# EasyEDA Pro project ProPrj_TC264 2025-12.27(1).epro

# Schematic Schematic1
Board Name: Board1; Create Date: 2025-09-16; Page Name: P1; Project Name: TC264; Schematic Name: Schematic1; Update Date: 2025-10-17; Company: 嘉立创EDA; Page Size: A4; Version: V1.0
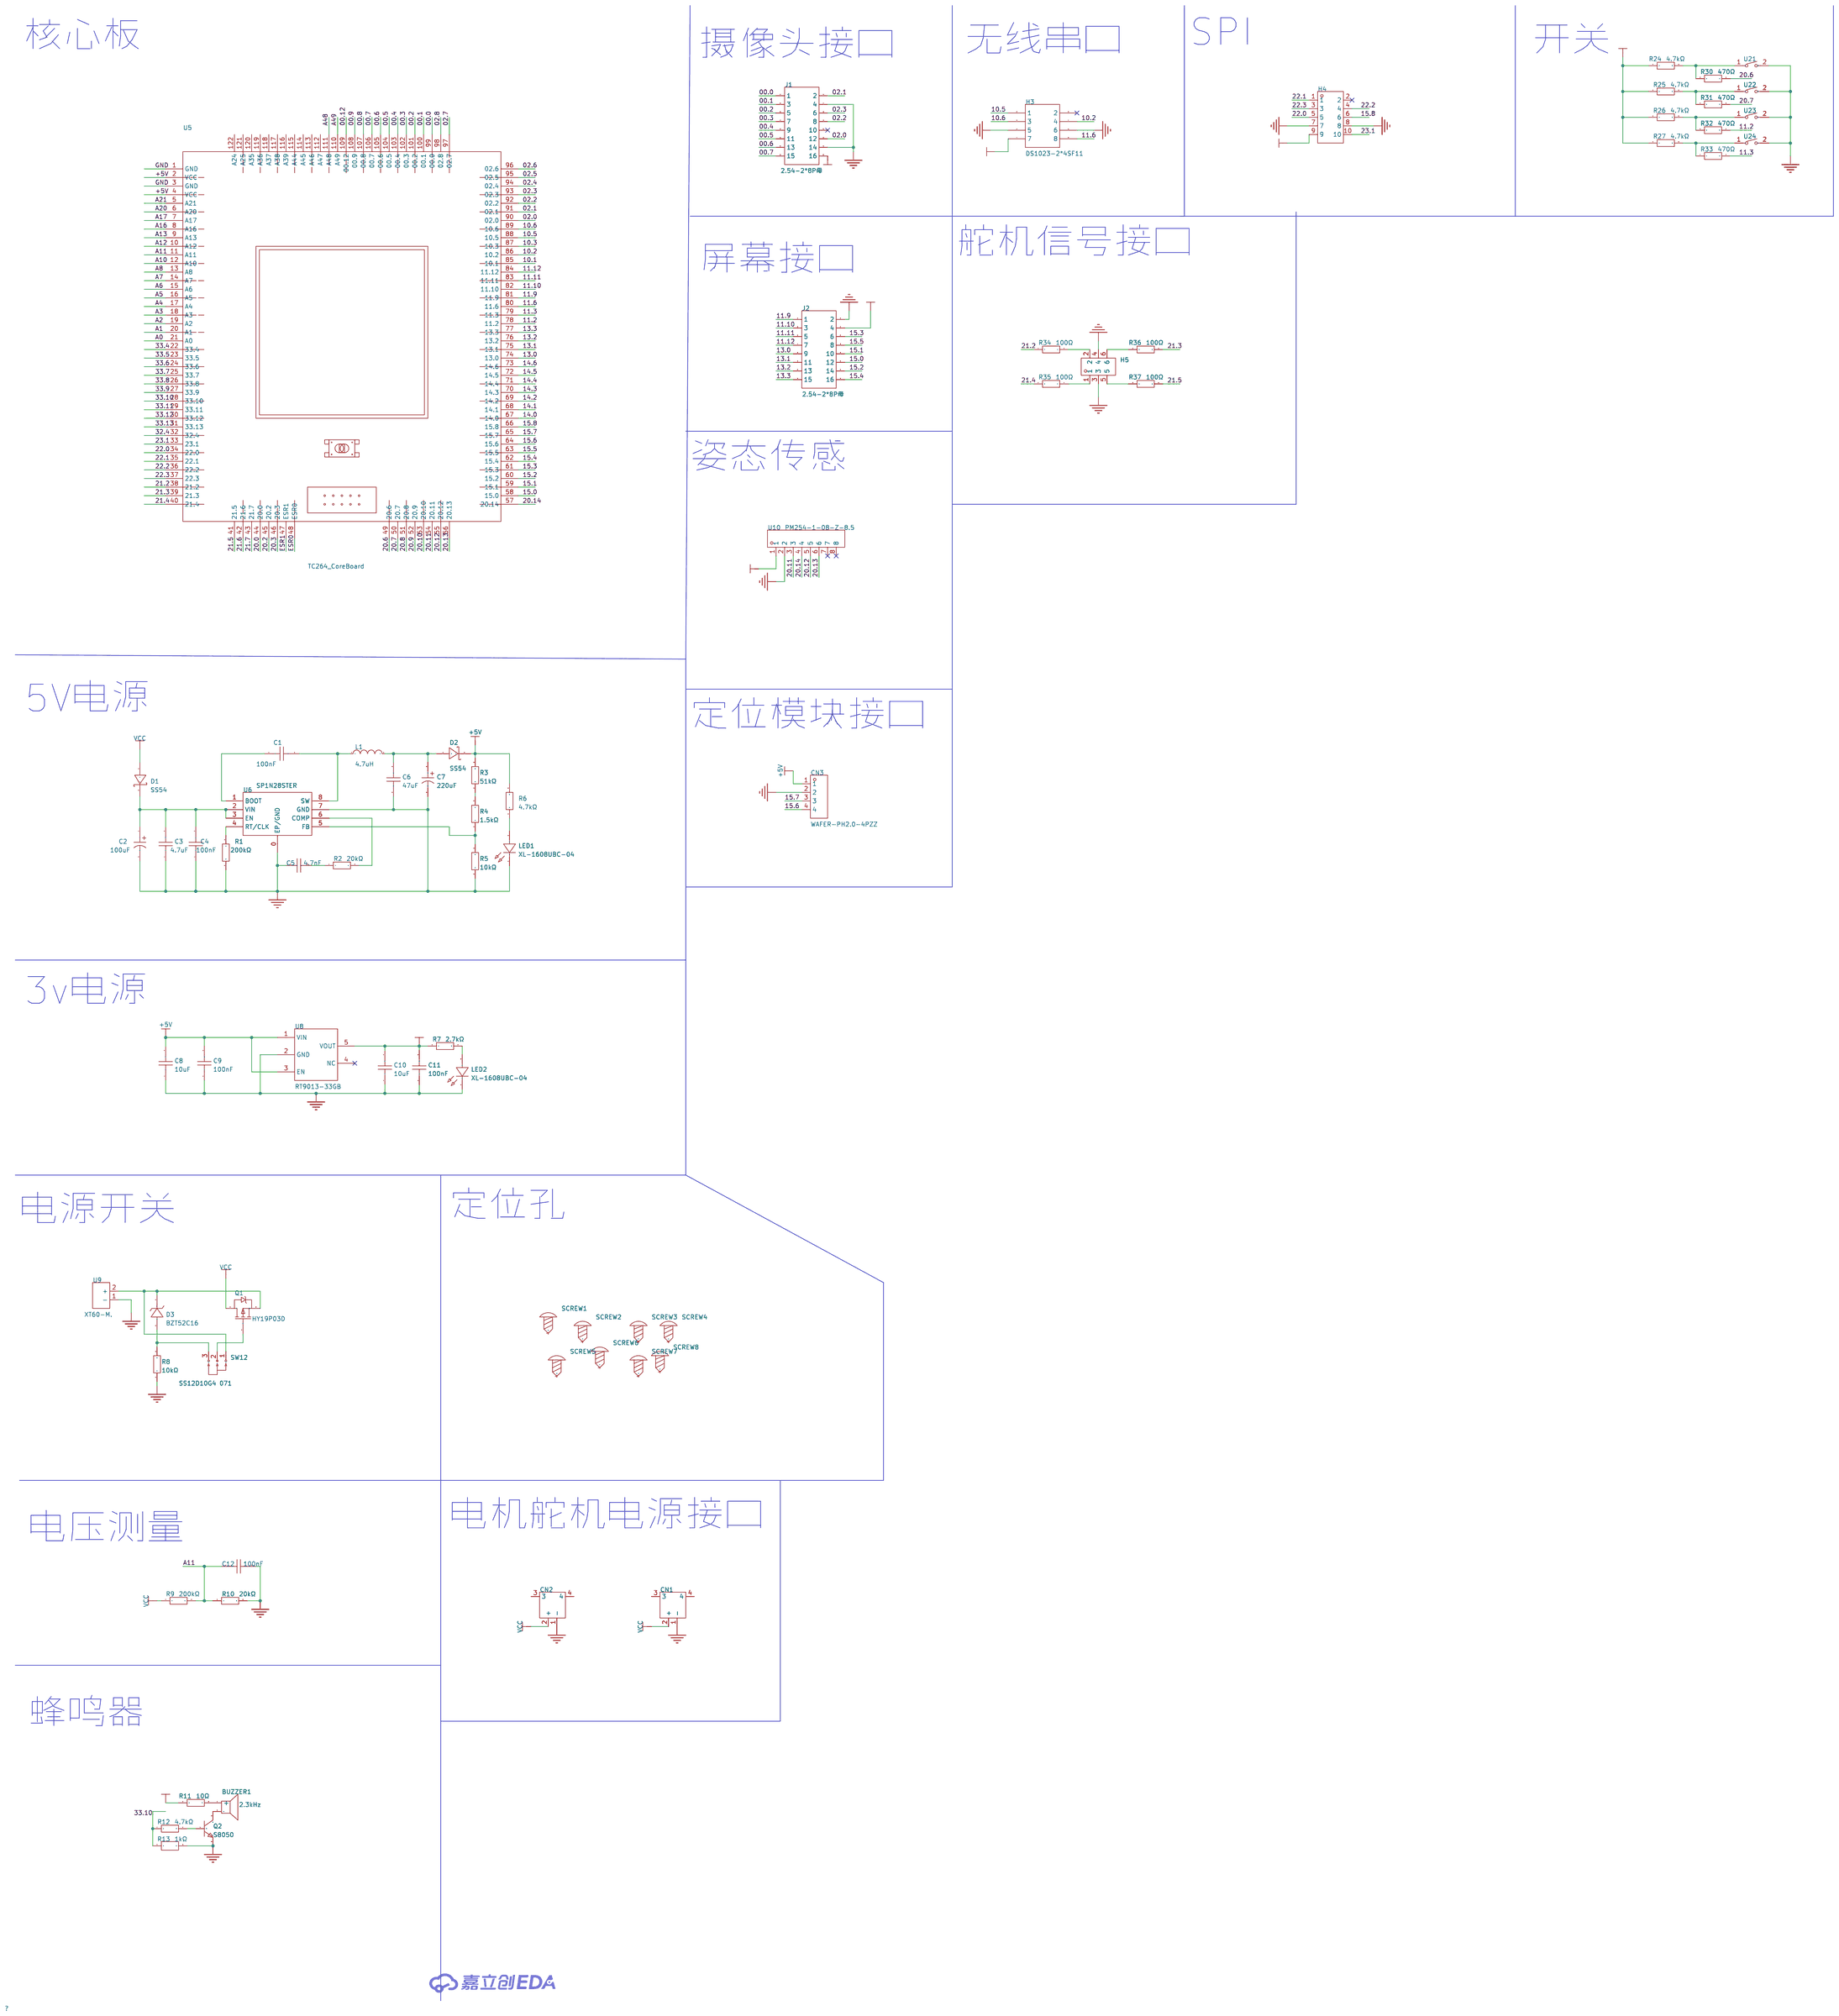
[diagram p0: schematic sheet]

## Parts
BUZZER1  2.3kHz  [BUZ-TH_BD12.0-P7.60-D0.6-FD]
C1  100nF  [C0603]
C2  100uF  [CAP-SMD_BD6.3-L6.6-W6.6-FD-1]
C3  4.7uF  [C1206]
C4  100nF  [C0603]
C5  4.7nF  [C0603]
C6  47uF  [C1206]
C7  220uF  [CAP-SMD_BD6.3-L6.6-W6.6-FD-1]
C8  10uF  [C0603]
C9  100nF  [C0603]
C10  10uF  [C0603]
C11  100nF  [C0603]
C12  100nF  [C0603]
CN1  XT30PW-M30.G.Y  [CONN-TH_XT30PW-M]
CN2  XT30PW-M30.G.Y  [CONN-TH_XT30PW-M]
CN3  WAFER-PH2.0-4PZZ  [CONN-TH_4P-P2.00_FWF20001-S04S22W5B]
D1  SS54  [footprint_93fc]
D2  SS54  [SMA_L4.4-W2.8-LS5.4-R-RD]
D3  BZT52C16  [SOD-123_L2.7-W1.7-LS3.8-RD]
H3  DS1023-2*4SF11  [HDR-TH_8P-P2.54-V-F-R2-C4-S2.54]
H4  PM254V-12-10P-H85  [HDR-TH_10P-P2.54-V-F-R2-C5-S2.54]
H5  PZ254V-12-6P  [HDR-TH_6P-P2.54-V-M-R2-C3-S2.54]
J1  2.54-2*8P母  [HDR-TH_16P-P2.54-V-F-R2-C8-S2.54]
J2  2.54-2*8P母  [HDR-TH_16P-P2.54-V-F-R2-C8-S2.54]
L1  4.7uH  [IND-SMD_L5.4-W5.2_FXL0530]
LED1  XL-1608UBC-04  [LED0603-RD_BLUE]
LED2  XL-1608UBC-04  [LED0603-RD_BLUE]
Q1  HY19P03D  [TO-252-2_L6.6-W6.1-P4.57-LS9.9-TL-CW]
Q2  S8050  [SOT-23-3_L3.0-W1.7-P0.95-LS2.9-BR]
R1  200kΩ  [R0805]
R2  20kΩ  [R0805]
R3  51kΩ  [R0805]
R4  1.5kΩ  [R0805]
R5  10kΩ  [R0805]
R6  4.7kΩ  [R0805]
R7  2.7kΩ  [R0805]
R8  10kΩ  [R0805]
R9  200kΩ  [R0603]
R10  20kΩ  [R0603]
R11  10Ω  [R0603]
R12  4.7kΩ  [R0603]
R13  1kΩ  [R0603]
R24  4.7kΩ  [R0603]
R25  4.7kΩ  [R0603]
R26  4.7kΩ  [R0603]
R27  4.7kΩ  [R0603]
R30  470Ω  [R0603]
R31  470Ω  [R0603]
R32  470Ω  [R0603]
R33  470Ω  [R0603]
R34  100Ω  [R0603]
R35  100Ω  [R0603]
R36  100Ω  [R0603]
R37  100Ω  [R0603]
SCREW1  -  [M3螺丝]
SCREW2  -  [M3螺丝]
SCREW3  -  [M3螺丝]
SCREW4  -  [M3螺丝]
SCREW5  -  [M3螺丝]
SCREW6  -  [M3螺丝]
SCREW7  -  [M3螺丝]
SCREW8  -  [M3螺丝]
SW12  SS12D10G4 071  [SW-TH_SHOU-HAN_SS12D10G4]
U5  TC264_CoreBoard  [TC264_main]
U6  SP1N28STER  [SOP-8E]
U8  RT9013-33GB  [SOT-23-5_L3.0-W1.7-P0.95-LS2.8-BL]
U9  XT60-M.  [CONN-TH_XT60]
U10  PM254-1-08-Z-8.5  [HDR-TH_8P-P2.54-V-F]
U21  GT-TC060A-H025-L1  [SW-SMD_L6.1-W3.5-LS8.0]
U22  GT-TC060A-H025-L1  [SW-SMD_L6.1-W3.5-LS8.0]
U23  GT-TC060A-H025-L1  [SW-SMD_L6.1-W3.5-LS8.0]
U24  GT-TC060A-H025-L1  [SW-SMD_L6.1-W3.5-LS8.0]

## Library data of the parts
BUZZER1 = TMB12A03: 驱动方式:有源(内含驱动线路);构造类型:电磁式;频率:2.3kHz;声压(SPL):85dB;; Supplier Part: C96222; Manufacturer: 华能; Supplier Footprint: 插件,D=12mm; JLCPCB Part Class: 扩展库; Datasheet: https://item.szlcsc.com/datasheet/TMB12A03/97426.html; Supplier: LCSC; Driver Circuitry: 有源(内含驱动线路); Technology: 电磁式; Voltage - Supply: 1.5V~4V; Sound Pressure Level(SPL): 85dB; Diameter(φD): 12mm; Height: 9.8mm
C1 = X-100nF-C0603-TP: 容值:100nF;精度:±10%;额定电压:50V;材质(温度系数):X7R;; Supplier: LCSC; Supplier Part: C14663; Supplier Footprint: 0603; JLCPCB Part Class: Basic Part; LCSC Part Name: 100nF ±10% 50V; Tolerance: ±10%; Datasheet: https://atta.szlcsc.com/upload/public/pdf/source/20170116/1484561234239.pdf; Manufacturer: YAGEO(国巨); Manufacturer Part: CC0603KRX7R9BB104; Temperature Coefficient: X7R; Voltage Rated: 50V
C2 = JVJ25V100M6x5: 容值:100uF;精度:±20%;额定电压:25V;纹波电流:72mA@120Hz;; LCSC Part Name: 100uF ±20% 25V; Supplier Part: C46550402; Manufacturer: JIERR(捷而瑞); Supplier Footprint: SMD,D6.3xL5.4mm; JLCPCB Part Class: Extended Part; Datasheet: https://item.szlcsc.com/datasheet/JVJ25V100M6x5/48680096.html; Supplier: LCSC; Tolerance: ±20%; Voltage Rating: 25V; Ripple Current: 72mA@120Hz; Diameter: 6.3mm; Height - Seated (Max): 5.4mm; Lifetime: 2000hrs@105℃; Operating Temperature: -55℃~+105℃
C3 = CGA1206X5R475K350NT: 容值:4.7uF;精度:±10%;额定电压:35V;材质(温度系数):X5R;; LCSC Part Name: 4.7uF ±10% 35V; Supplier Part: C22399656; Manufacturer: HRE(芯声); Supplier Footprint: 1206; JLCPCB Part Class: 扩展库; Datasheet: https://atta.szlcsc.com/upload/public/pdf/source/20240523/B8FD0004515F911A9E977ED73F0FE1A1.pdf; Supplier: LCSC; Tolerance: ±10%; Voltage Rating: 35V; Temperature Coefficient: X5R
C4 = CC0603KRX7R9BB104: 容值:100nF;精度:±10%;额定电压:50V;温度系数:X7R;; LCSC Part Name: 100nF ±10% 50V; Supplier Part: C14663; Manufacturer: YAGEO(国巨); Supplier Footprint: 0603; JLCPCB Part Class: 基础库; Datasheet: https://item.szlcsc.com/datasheet/CC0603KRX7R9BB104/15331.html; Supplier: LCSC; Tolerance: ±10%; Voltage Rating: 50V; Temperature Coefficient: X7R
C5 = CL10B472KB8NNNC: 容值:4.7nF;精度:±10%;额定电压:50V;温度系数:X7R;; LCSC Part Name: 4.7nF ±10% 50V; Supplier Part: C1621; Manufacturer: SAMSUNG(三星); Supplier Footprint: 0603; JLCPCB Part Class: 扩展库; Datasheet: https://item.szlcsc.com/datasheet/CL10B472KB8NNNC/1973.html; Supplier: LCSC; Tolerance: ±10%; Voltage Rating: 50V; Temperature Coefficient: X7R
C6 = HGC1206R5476M250NSPJ: 容值:47uF;精度:±20%;额定电压:25V;温度系数:X5R;; LCSC Part Name: 47uF ±20% 25V; Supplier Part: C22367835; Manufacturer: Chinocera(华瓷); Supplier Footprint: 1206; JLCPCB Part Class: 扩展库; Datasheet: https://item.szlcsc.com/datasheet/HGC1206R5476M250NSPJ/23841140.html; Supplier: LCSC; Tolerance: ±20%; Voltage Rating: 25V; Temperature Coefficient: X5R
C7 = RVT25V220M6X8: 容值:220uF;精度:±20%;额定电压:25V;纹波电流:100mA@120Hz;; LCSC Part Name: 220uF ±20% 25V; Supplier Part: C47023109; Manufacturer: JIERR(捷而瑞); Supplier Footprint: SMD,D6.3xL7.7mm; JLCPCB Part Class: Extended Part; Datasheet: https://item.szlcsc.com/datasheet/RVT25V220M6X8/49206210.html; Supplier: LCSC; Tolerance: ±20%; Voltage Rating: 25V; Ripple Current: 100mA@120Hz; Diameter: 6.3mm; Height - Seated (Max): 7.7mm; Lifetime: 2000hrs@105℃; Operating Temperature: -55℃~+105℃
C8 C10 = CL10A106MA8NRNC: 容值:10uF;精度:±20%;额定电压:25V;温度系数:X5R;; LCSC Part Name: 10uF ±20% 25V; Supplier Part: C96446; Manufacturer: SAMSUNG(三星); Supplier Footprint: 0603; JLCPCB Part Class: 基础库; Datasheet: https://item.szlcsc.com/datasheet/CL10A106MA8NRNC/97651.html; Supplier: LCSC; Tolerance: ±20%; Voltage Rating: 25V; Temperature Coefficient: X5R
C9 C11 = CGA0603X7R104K500JT: 容值:100nF;精度:±10%;额定电压:50V;温度系数:X7R;; LCSC Part Name: 100nF ±10% 50V; Supplier Part: C6119867; Manufacturer: HRE(芯声); Supplier Footprint: 0603; JLCPCB Part Class: 扩展库; Datasheet: https://atta.szlcsc.com/upload/public/pdf/source/20250103/C44077DA9E7B3EFAE02F22B6D3D1CBC9.pdf; Supplier: LCSC; Tolerance: ±10%; Voltage Rating: 50V; Temperature Coefficient: X7R
C12 = FCC0603B104K500CT: 容值:100nF;精度:±10%;额定电压:50V;温度系数:X7R;; LCSC Part Name: 100nF ±10% 50V; Supplier Part: C5137636; Manufacturer: FOJAN(富捷); Supplier Footprint: 0603; JLCPCB Part Class: 扩展库; Datasheet: https://item.szlcsc.com/datasheet/FCC0603B104K500CT/5747088.html; Supplier: LCSC; Tolerance: ±10%; Voltage Rating: 50V; Temperature Coefficient: X7R
CN1 CN2 = XT30PW-M30.G.Y: 类别:-;类型1:-;; LCSC Part Name: AMASS(艾迈斯)航模插头 卧式弯脚 XT30PW-M公头; Supplier Part: C431092; Manufacturer: AMASS(艾迈斯); JLCPCB Part Class: 扩展库; Datasheet: https://item.szlcsc.com/datasheet/XT30PW-M30.G.Y/426930.html; Supplier: LCSC; Type: 航模插头; RatedVoltage: DC 500V; InterfaceType: 公头; RatedCurrent: 15A; RecommendedWireGauge: 16/18/20AWG; contact resistance: 1.2mΩ; specifications: 2pin
CN3 = WAFER-PH2.0-4PZZ: 插针结构:1x4P;间距:2mm;安装方式:直插;参考系列:PH;总PIN数:4P;排数:1;每排PIN数:4;行距:-;额定电流:2A;触头材质:黄铜;触头镀层:锡;工作温度:-25℃~+85℃;; LCSC Part Name: 1x4P 间距:2mm 直插 系列:PH; Supplier Part: C5359601; Manufacturer: XUNPU(讯普); Supplier Footprint: 插件,P=2mm; JLCPCB Part Class: 扩展库; Datasheet: https://item.szlcsc.com/datasheet/WAFER-PH2.0-4PZZ/6173837.html; Supplier: LCSC; Pins Structure: 1x4P; Pitch: 2mm; Mounting Type: 直插; Reference Series: PH; Number of Pins: 4P; Number of Rows: 1; Number of PINs Per Row: 4; Current Rating: 2A; Contact Material: 黄铜; Contact Plating: 锡; Operating Temperature: -25℃~+85℃; Voltage Rating: 250V; Plastic Material: PA66; Flame Retardant Rating: UL94V-0; Color: 白色; Z-Height of the Board: 6.05mm; X-Length of Bottom Edge on Board (Spacing Line): 10mm; Y-Width of Bottom Edge on Board: 4.7mm
D1 = SS54: Supplier: LCSC; Manufacturer: MDD; image: //image.lceda.cn/szlcsc/C22452.jpg; Supplier Part: C22452; JLCPCB Part Class: Basic
D2 = SS54_C22452: 二极管配置:独立式;正向压降(Vf):550mV@5A;直流反向耐压(Vr):40V;整流电流:5A;; LCSC Part Name: 电压:40V 电流:5A; Supplier Part: C22452; Manufacturer: MDD(辰达半导体); Supplier Footprint: SMA(DO-214AC); JLCPCB Part Class: 基础库; Datasheet: https://item.szlcsc.com/datasheet/SS54/23178.html; Supplier: LCSC; Diode Configuration: 独立式; Voltage - Forward(Vf@If): 550mV@5A; Voltage - DC Reverse(Vr): 40V; Current - Rectified: 5A; Reverse Leakage Current (Ir): 1mA@40V; Operating Junction Temperature Range: -55℃~+125℃
D3 = BZT52C16_C727007: 二极管配置:独立式;稳压值(标称值):16V;稳压值(范围):15.3V~17.1V;耗散功率(Pd):500mW;; LCSC Part Name: 独立式 耐压:16V 电流:10.1uA@11.2V; Supplier Part: C727007; Manufacturer: TWGMC(迪嘉); Supplier Footprint: SOD-123; JLCPCB Part Class: 扩展库; Datasheet: https://item.szlcsc.com/datasheet/BZT52C16/774112.html; Supplier: LCSC; Diode Configuration: 独立式; Zener Voltage(Nom): 16V; Reverse Leakage Current (Ir): 10.1uA@11.2V; Zener Voltage(Range): 15.3V~17.1V; Pd - Power Dissipation: 500mW; Impedance(Zzt): 40Ω; Operating Junction Temperature Range: -55℃~+150℃
H3 = DS1023-2*4SF11: 插孔结构:2x4P;间距:2.54mm;行距:2.54mm;安装方式:直插;排数:双排;总孔位数:8P;塑高:-;触头材质:-;触头镀层:-;; LCSC Part Name: 黑色 间距:2.54mm 2x4P 直插; Supplier Part: C92271; Manufacturer: CONNFLY; Supplier Footprint: 插件,P=2.54mm; JLCPCB Part Class: 扩展库; Datasheet: https://item.szlcsc.com/datasheet/DS1023-2*4SF11/93464.html; Supplier: LCSC; Holes Structure: 2x4P; Pitch: 2.54mm; Row Spacing: 2.54mm; Mounting Type: 直插; Number of Rows: 双排; Number of Positions: 8P
H4 = PM254V-12-10P-H85: 插孔结构:2x5P;间距:2.54mm;行距:2.54mm;安装方式:直插;排数:双排;总孔位数:10P;塑高:-;触头材质:黄铜;触头镀层:-;; LCSC Part Name: 间距:2.54mm 2x5P 直插; Supplier Part: C492399; Manufacturer: XFCN(兴飞); Supplier Footprint: 插件,P=2.54mm; JLCPCB Part Class: 扩展库; Datasheet: https://item.szlcsc.com/datasheet/PM254V-12-10P-H85/502955.html; Supplier: LCSC; Holes Structure: 2x5P; Pitch: 2.54mm; Row Spacing: 2.54mm; Mounting Type: 直插; Number of Rows: 双排; Number of Positions: 10P; Contact Material: 黄铜
H5 = PZ254V-12-6P: 插针结构:2x3P;间距:2.54mm;行距:2.54mm;圆针/方针:方针;安装类型:直插;排数:双排;总PIN位数:6P;额定电流:-;额定电压:-;配合针长度:6mm;塑高:2.5mm;端接针长度:3mm;触头材质:黄铜;触头镀层:-;工作温度范围:-40℃~+105℃;颜色:黑色;; LCSC Part Name: 间距:2.54mm 2x3P 直插 方针; Supplier Part: C492420; Manufacturer: XFCN(兴飞); Supplier Footprint: 插件,P=2.54mm; JLCPCB Part Class: 扩展库; Datasheet: https://atta.szlcsc.com/upload/public/pdf/source/20200309/C492420_BAECB307B001054C09D200388220EAE6.pdf; Supplier: LCSC; Pin Structure: 2x3P; Pitch: 2.54mm; Row Spacing: 2.54mm; Circluar Pins/Square Pins: 方针; Mounting Type: 直插; Number of Rows: 双排; Number of Pins: 6P; Length of Mating Pin: 6mm; Insulation Height: 2.5mm; Length of End Connection Pin: 3mm; Contact Material: 黄铜; Operating Temperature Range: -40℃~+105℃; Color: 黑色
J1 J2 = 2.54-2*8P母: 插孔结构:2x8P;间距:2.54mm;行距:2.54mm;安装方式:直插;排数:双排;总孔位数:16P;塑高:-;触头材质:黄铜;触头镀层:-;; LCSC Part Name: 间距:2.54mm 2x8P 直插; Supplier Part: C30734; Manufacturer: BOOMELE(博穆精密); Supplier Footprint: 插件,P=2.54mm; JLCPCB Part Class: 扩展库; Datasheet: https://item.szlcsc.com/datasheet/2.54-2*8P%25E6%25AF%258D/31491.html; Supplier: LCSC; Holes Structure: 2x8P; Pitch: 2.54mm; Row Spacing: 2.54mm; Mounting Type: 直插; Number of Rows: 双排; Number of Positions: 16P; Contact Material: 黄铜
L1 = FXL0530-4R7-M: 电感值:4.7uH;精度:±20%;额定电流:4.5A;饱和电流(Isat):5A;类型:一体成型电感;; LCSC Part Name: 4.7uH ±20% 5A; Supplier Part: C177246; Manufacturer: cjiang(长江微电); Supplier Footprint: SMD,5.4x5.2mm; JLCPCB Part Class: 扩展库; Datasheet: https://item.szlcsc.com/datasheet/FXL0530-4R7-M/188638.html; Supplier: LCSC; Tolerance: ±20%; Current Rating: 4.5A; Current - Saturation(Isat): 5A; DC Resistance(DCR): 60mΩ; Type: 一体成型电感
LED1 LED2 = XL-1608UBC-04: 灯头类型:-;发光颜色:蓝色;正向压降(Vf):3.3V;功率:70mW;正向电流:20mA;波长:455nm~475nm;二极管配置:-;透镜颜色:无色透明透镜;色温:-;发光强度:300mcd;发光角度:120°;载带方式:正贴;工作温度:-;; LCSC Part Name: 0603蓝色贴片式发光二极管; Supplier Part: C965807; Manufacturer: XINGLIGHT(成兴光); Supplier Footprint: 0603; JLCPCB Part Class: 扩展库; Datasheet: https://item.szlcsc.com/datasheet/XL-1608UBC-04/1051416.html; Supplier: LCSC; Illumination Color: 蓝色; Voltage - Forward(Vf): 3.3V; Power(Watts): 70mW; Forward Current: 20mA; Wavelength - Dominant: 455nm~475nm; Peak Wavelength: 470nm; Lens Color: 无色透明透镜; Luminous Intensity: 300mcd; Viewing Angle: 120°; Mounting Style: 正贴
Q1 = HY19P03D: 类型:P沟道;漏源电压(Vdss):30V;连续漏极电流(Id):90A;功率(Pd):50W;导通电阻(RDS(on)@Vgs,Id):6mΩ@10V,45A;阈值电压(Vgs(th)@Id):3V@250uA;; LCSC Part Name: P沟道 耐压:30V 电流:90A; Supplier Part: C122492; Manufacturer: HUAYI(华羿微); Supplier Footprint: TO-252-2; JLCPCB Part Class: 扩展库; Datasheet: https://atta.szlcsc.com/upload/public/pdf/source/20170728/C122492_1501225751911848809.pdf; Supplier: LCSC; Type: P沟道; Drain Source Voltage (Vdss): 30V; Continuous Drain Current (Id): 90A; Power Dissipation (Pd): 50W; Drain Source On Resistance (RDS(on)@Vgs,Id): 6mΩ@10V,45A; Gate Threshold Voltage (Vgs(th)@Id): 3V@250uA
Q2 = S8050_C364312: 晶体管类型:NPN;集电极电流(Ic):500mA;集射极击穿电压(Vceo):25V;耗散功率(Pd):300mW;直流电流增益(hFE):-;; LCSC Part Name: hFE:200-350 NPN 电流:500mA 电压:25V; Supplier Part: C364312; Manufacturer: MDD(辰达半导体); Supplier Footprint: SOT-23; JLCPCB Part Class: 扩展库; Datasheet: https://item.szlcsc.com/datasheet/S8050/338624.html; Supplier: LCSC; type: NPN; Current - Collector(Ic): 500mA; Collector - Emitter Voltage VCEO: 25V; Pd - Power Dissipation: 300mW; Transition frequency(fT): 150MHz; Current - Collector Cutoff: 100nA; Vce Saturation(VCE(sat)): 600mV@500mA,50mA; Operating Temperature: -55℃~+150℃; Emitter-Base Voltage(Vebo): 5V
R1 = 0805W8F2003T5E: 电阻类型:厚膜电阻;阻值:200kΩ;精度:±1%;功率:125mW;最大工作电压:150V;温度系数:±100ppm/℃;; LCSC Part Name: 200kΩ ±1% 125mW 厚膜电阻; Supplier Part: C17539; Manufacturer: UNI-ROYAL(厚声); Supplier Footprint: 0805; JLCPCB Part Class: 基础库; Datasheet: https://atta.szlcsc.com/upload/public/pdf/source/20200306/C422600_1E6D84923E4A46A82E41ADD87F860B5C.pdf; Supplier: LCSC; Type: 厚膜电阻; Tolerance: ±1%; Power(Watts): 125mW; Overload Voltage (Max): 150V; Temperature Coefficient: ±100ppm/℃; Operating Temperature Range: -55℃~+155℃
R2 = 0805W8F2002T5E: 电阻类型:厚膜电阻;阻值:20kΩ;精度:±1%;功率:125mW;最大工作电压:150V;温度系数:±100ppm/℃;; LCSC Part Name: 20kΩ ±1% 125mW 厚膜电阻; Supplier Part: C4328; Manufacturer: UNI-ROYAL(厚声); Supplier Footprint: 0805; JLCPCB Part Class: 基础库; Datasheet: https://atta.szlcsc.com/upload/public/pdf/source/20200306/C422600_1E6D84923E4A46A82E41ADD87F860B5C.pdf; Supplier: LCSC; Type: 厚膜电阻; Tolerance: ±1%; Power(Watts): 125mW; Overload Voltage (Max): 150V; Temperature Coefficient: ±100ppm/℃; Operating Temperature Range: -55℃~+155℃
R3 = 0805W8F5102T5E: 电阻类型:厚膜电阻;阻值:51kΩ;精度:±1%;功率:125mW;工作电压:150V;温度系数:±100ppm/℃;; LCSC Part Name: 51kΩ ±1% 125mW 厚膜电阻; Supplier Part: C17737; Manufacturer: UNI-ROYAL(厚声); Supplier Footprint: 0805; JLCPCB Part Class: 基础库; Datasheet: https://item.szlcsc.com/datasheet/0805W8F5102T5E/18425.html; Supplier: LCSC; Type: 厚膜电阻; Tolerance: ±1%; Power(Watts): 125mW; Voltage-Supply(Max): 150V; Temperature Coefficient: ±100ppm/℃; Operating Temperature: -55℃~+155℃
R4 = 0805W8F1501T5E: 电阻类型:厚膜电阻;阻值:1.5kΩ;精度:±1%;功率:125mW;最大工作电压:150V;温度系数:±100ppm/℃;; LCSC Part Name: 1.5kΩ ±1% 125mW 厚膜电阻; Supplier Part: C4310; Manufacturer: UNI-ROYAL(厚声); Supplier Footprint: 0805; JLCPCB Part Class: 基础库; Datasheet: https://atta.szlcsc.com/upload/public/pdf/source/20200306/C422600_1E6D84923E4A46A82E41ADD87F860B5C.pdf; Supplier: LCSC; Type: 厚膜电阻; Tolerance: ±1%; Power(Watts): 125mW; Overload Voltage (Max): 150V; Temperature Coefficient: ±100ppm/℃; Operating Temperature Range: -55℃~+155℃
R5 = 0805W8J0103T5E: 电阻类型:厚膜电阻;阻值:10kΩ;精度:±5%;功率:125mW;工作电压:150V;温度系数:±100ppm/℃;; LCSC Part Name: 10kΩ ±5% 125mW 厚膜电阻; Supplier Part: C25612; Manufacturer: UNI-ROYAL(厚声); Supplier Footprint: 0805; JLCPCB Part Class: 扩展库; Datasheet: https://item.szlcsc.com/datasheet/0805W8J0103T5E/26355.html; Supplier: LCSC; Type: 厚膜电阻; Tolerance: ±5%; Power(Watts): 125mW; Voltage-Supply(Max): 150V; Temperature Coefficient: ±100ppm/℃; Operating Temperature: -55℃~+155℃
R6 = 0805W8F4701T5E: 电阻类型:厚膜电阻;阻值:4.7kΩ;精度:±1%;功率:125mW;最大工作电压:150V;温度系数:±100ppm/℃;; LCSC Part Name: 4.7kΩ ±1% 125mW 厚膜电阻; Supplier Part: C17673; Manufacturer: UNI-ROYAL(厚声); Supplier Footprint: 0805; JLCPCB Part Class: 基础库; Datasheet: https://atta.szlcsc.com/upload/public/pdf/source/20200306/C422600_1E6D84923E4A46A82E41ADD87F860B5C.pdf; Supplier: LCSC; Type: 厚膜电阻; Tolerance: ±1%; Power(Watts): 125mW; Overload Voltage (Max): 150V; Temperature Coefficient: ±100ppm/℃; Operating Temperature Range: -55℃~+155℃
R7 = 0805W8F2701T5E: 电阻类型:厚膜电阻;阻值:2.7kΩ;精度:±1%;功率:125mW;工作电压:150V;温度系数:±100ppm/℃;; LCSC Part Name: 2.7kΩ ±1% 125mW 厚膜电阻; Supplier Part: C17530; Manufacturer: UNI-ROYAL(厚声); Supplier Footprint: 0805; JLCPCB Part Class: 基础库; Datasheet: https://item.szlcsc.com/datasheet/0805W8F2701T5E/18218.html; Supplier: LCSC; Type: 厚膜电阻; Tolerance: ±1%; Power(Watts): 125mW; Voltage-Supply(Max): 150V; Temperature Coefficient: ±100ppm/℃; Operating Temperature: -55℃~+155℃
R8 = 0805W8F1002T5E_C17414: 电阻类型:厚膜电阻;阻值:10kΩ;精度:±1%;功率:125mW;工作电压:150V;温度系数:±100ppm/℃;; LCSC Part Name: 10kΩ ±1% 125mW 厚膜电阻; Supplier Part: C17414; Manufacturer: UNI-ROYAL(厚声); Manufacturer Part: 0805W8F1002T5E; Supplier Footprint: 0805; JLCPCB Part Class: 基础库; Datasheet: https://item.szlcsc.com/datasheet/0805W8F1002T5E/18102.html; Supplier: LCSC; Type: 厚膜电阻; Tolerance: ±1%; Power(Watts): 125mW; Voltage-Supply(Max): 150V; Temperature Coefficient: ±100ppm/℃; Operating Temperature: -55℃~+155℃
R9 = 0603WAF2003T5E: 电阻类型:厚膜电阻;阻值:200kΩ;精度:±1%;功率:100mW;最大工作电压:75V;温度系数:±100ppm/℃;; LCSC Part Name: 200kΩ ±1% 100mW 厚膜电阻; Supplier Part: C25811; Manufacturer: UNI-ROYAL(厚声); Supplier Footprint: 0603; JLCPCB Part Class: 基础库; Datasheet: https://atta.szlcsc.com/upload/public/pdf/source/20200306/C422600_1E6D84923E4A46A82E41ADD87F860B5C.pdf; Supplier: LCSC; Type: 厚膜电阻; Tolerance: ±1%; Power(Watts): 100mW; Overload Voltage (Max): 75V; Temperature Coefficient: ±100ppm/℃; Operating Temperature Range: -55℃~+155℃
R10 = 0603WAF2002T5E: 电阻类型:厚膜电阻;阻值:20kΩ;精度:±1%;功率:100mW;工作电压:75V;温度系数:±100ppm/℃;; LCSC Part Name: 20kΩ ±1% 100mW 厚膜电阻; Supplier Part: C4184; Manufacturer: UNI-ROYAL(厚声); Supplier Footprint: 0603; JLCPCB Part Class: 基础库; Datasheet: https://item.szlcsc.com/datasheet/0603WAF2002T5E/4591.html; Supplier: LCSC; Type: 厚膜电阻; Tolerance: ±1%; Power(Watts): 100mW; Voltage-Supply(Max): 75V; Temperature Coefficient: ±100ppm/℃; Operating Temperature: -55℃~+155℃
R11 = 0603WAF100JT5E: 电阻类型:厚膜电阻;阻值:10Ω;精度:±1%;功率:100mW;工作电压:75V;温度系数:±400ppm/℃;; LCSC Part Name: 10Ω ±1% 100mW 厚膜电阻; Supplier Part: C22859; Manufacturer: UNI-ROYAL(厚声); Supplier Footprint: 0603; JLCPCB Part Class: 基础库; Datasheet: https://item.szlcsc.com/datasheet/0603WAF100JT5E/23586.html; Supplier: LCSC; Type: 厚膜电阻; Tolerance: ±1%; Power(Watts): 100mW; Voltage-Supply(Max): 75V; Temperature Coefficient: ±400ppm/℃; Operating Temperature: -55℃~+155℃
R12 R24-R27 = 0603WAF4701T5E: 电阻类型:厚膜电阻;阻值:4.7kΩ;精度:±1%;功率:100mW;工作电压:75V;温度系数:±100ppm/℃;; LCSC Part Name: 4.7kΩ ±1% 100mW 厚膜电阻; Supplier Part: C23162; Manufacturer: UNI-ROYAL(厚声); Supplier Footprint: 0603; JLCPCB Part Class: 基础库; Datasheet: https://item.szlcsc.com/datasheet/0603WAF4701T5E/23889.html; Supplier: LCSC; Type: 厚膜电阻; Tolerance: ±1%; Power(Watts): 100mW; Voltage-Supply(Max): 75V; Temperature Coefficient: ±100ppm/℃; Operating Temperature: -55℃~+155℃
R13 = FRC0603F1001TS: 电阻类型:厚膜电阻;阻值:1kΩ;精度:±1%;功率:100mW;工作电压:75V;温度系数:±100ppm/℃;; LCSC Part Name: 1kΩ ±1% 100mW 厚膜电阻; Supplier Part: C2907002; Manufacturer: FOJAN(富捷); Supplier Footprint: 0603; JLCPCB Part Class: 扩展库; Supplier: LCSC; Type: 厚膜电阻; Tolerance: ±1%; Power(Watts): 100mW; Voltage-Supply(Max): 75V; Temperature Coefficient: ±100ppm/℃; Operating Temperature: -55℃~+155℃
R30-R33 = 0603WAF4700T5E: 电阻类型:厚膜电阻;阻值:470Ω;精度:±1%;功率:100mW;工作电压:75V;温度系数:±100ppm/℃;; LCSC Part Name: 470Ω ±1% 100mW 厚膜电阻; Supplier Part: C23179; Manufacturer: UNI-ROYAL(厚声); Supplier Footprint: 0603; JLCPCB Part Class: 基础库; Datasheet: https://item.szlcsc.com/datasheet/0603WAF4700T5E/23906.html; Supplier: LCSC; Type: 厚膜电阻; Tolerance: ±1%; Power(Watts): 100mW; Voltage-Supply(Max): 75V; Temperature Coefficient: ±100ppm/℃; Operating Temperature: -55℃~+155℃
R34-R37 = 0603WAF1000T5E: 电阻类型:厚膜电阻;阻值:100Ω;精度:±1%;功率:100mW;最大工作电压:75V;温度系数:±200ppm/℃;; LCSC Part Name: 100Ω ±1% 100mW 厚膜电阻; Supplier Part: C22775; Manufacturer: UNI-ROYAL(厚声); Supplier Footprint: 0603; JLCPCB Part Class: 基础库; Datasheet: https://atta.szlcsc.com/upload/public/pdf/source/20200306/C422600_1E6D84923E4A46A82E41ADD87F860B5C.pdf; Supplier: LCSC; Type: 厚膜电阻; Tolerance: ±1%; Power(Watts): 100mW; Overload Voltage (Max): 75V; Temperature Coefficient: ±200ppm/℃; Operating Temperature Range: -55℃~+155℃
SCREW1-SCREW8 = M3螺丝: Supplier Footprint: 插件
SW12 = SS12D10G4 071: 电路结构:单刀双掷;安装方式:立插;开关颜色:-;额定电流(DC):2A;额定电压(DC):125V;额定电流(AC):-;额定电压(AC):-;机械寿命:3千次;; Supplier Part: C2887259; Manufacturer: SHOU HAN(首韩); Supplier Footprint: 插件; JLCPCB Part Class: 扩展库; Datasheet: https://atta.szlcsc.com/upload/public/pdf/source/20210820/80D1704BBF3FCEE0435FCAA54C61E0A3.pdf; Supplier: LCSC; Circuit: 单刀双掷; Pin Style: PC引脚; Switch Length: 12.7mm; Switch Width: 6.7mm; Switch Height: 6.4mm; Mounting Style: 立插; Current Rating (DC): 2A; Voltage Rating (DC): 125V; Mechanical Life: 3千次; Operating Temperature: -16℃~+60℃
U5 = TC264
U6 = SP1N28STER: Revision: V1.0
U8 = RT9013-33GB: 输出类型:固定;工作电压:5.5V;输出电压:3.3V;输出电流:500mA;电源纹波抑制比(PSRR):50dB@(10kHz);输出极性:正极;; LCSC Part Name: 输入5.5V 输出3.3V 500mA; Supplier Part: C47773; Manufacturer: RICHTEK(立锜); Supplier Footprint: SOT-23-5; JLCPCB Part Class: 扩展库; Datasheet: https://item.szlcsc.com/datasheet/RT9013-33GB/48778.html; Supplier: LCSC; Output Type: 固定; Voltage - Supply: 5.5V; Output Voltage: 3.3V; Output Current: 500mA; Power Supply Rejection Ratio (PSRR): 50dB@(10kHz); Voltage Dropout: 400mV@(500mA); standby current: 25uA; Noise: 30uVrms; Features: 带使能；过热保护；过流保护; Operating Temperature: -40℃~+125℃@(Tj); Output Configuration: 正极; Number of Outputs: 1
U9 = XT60-M.: 类别:-;类型1:-;; LCSC Part Name: AMASS(艾迈斯) XT60模型插头 3.5mm镀金香蕉头公头（电调端）XT60-M; Supplier Part: C98733; Manufacturer: AMASS(艾迈斯); JLCPCB Part Class: 扩展库; Datasheet: https://item.szlcsc.com/datasheet/XT60-M./99943.html; Supplier: LCSC; Type: 香蕉头; Colour: 黄色; InterfaceType: 公头; specifications: 3.5mm
U10 = PM254-1-08-Z-8.5: 插孔结构:1x8P;间距:2.54mm;行距:-;圆孔/方孔:方孔;安装方式:直插;排数:单排;总孔位数:8P;额定电流:3A;额定电压:-;插孔方向:顶部;塑高:8.5mm;触头材质:铜合金;工作温度:-40℃~+105℃;; LCSC Part Name: 1x8P 间距:2.54mm 直插; Supplier Part: C2897371; Manufacturer: HCTL(华灿天禄); Supplier Footprint: 插件,P=2.54mm; JLCPCB Part Class: 扩展库; Datasheet: https://item.szlcsc.com/datasheet/PM254-1-08-Z-8.5/3142376.html; Supplier: LCSC; Holes Structure: 1x8P; Pitch: 2.54mm; Circular Hole / Square Hole: 方孔; Mounting Type: 直插; Number of Rows: 单排; Number of Positions: 8P; Current Rating: 3A; Holes Direction: 顶部; Insulation Height: 8.5mm; Contact Material: 铜合金; Operating Temperature: -40℃~+105℃
U21-U24 = GT-TC060A-H025-L1: 电路结构:单刀单掷;按钮形状:矩形按钮;作用力:1.6N;安装方式:立贴;开关长度:6.05mm;开关宽度:3.5mm;开关高度:2.5mm;带支架:不带;触点电流:50mA;额定电压(AC):-;额定电压(DC):12V;绝缘电阻:100MΩ;带灯:无;机械寿命:10万次;; LCSC Part Name: 3x6 两脚立式轻触开关 H2.5mm 160gf; Supplier Part: C5117870; Manufacturer: G-Switch(品赞); Supplier Footprint: SMD; JLCPCB Part Class: 扩展库; Datasheet: https://atta.szlcsc.com/upload/public/pdf/source/20220727/66542626AE211ABCA7EA42BB18BFEDDD.pdf; Supplier: LCSC; Circuit: 单刀单掷; Actuator Style: 矩形按钮; Operating Force: 1.6N; Mounting Style: 立贴; Switch Length: 6.05mm; Switch Width: 3.5mm; Switch Height: 2.5mm; Strike Gundam: 不带; Contact Current: 50mA; Voltage Rating (DC): 12V; Insulation Resistance: 100MΩ; Actuator/Cap Color: 白色; With Lamp: 无; Pin Style: PC引脚; Mechanical Life: 10万次; Operating Temperature: -30℃~+85℃

## Nets
3V: C10.2 C11.2 J1.16 J2.4 R7.1 R11.1 R24.1 R25.1 R26.1 R27.1 U8.5(VOUT) U10.1
+5V: C8.2 C9.2 CN3.1 D2.2(K) H3.7 H4.9 R3.2 R6.2 U5.2(VCC) U5.4(VCC) U8.1(VIN) U8.3(EN)
GND: C2.2 C3.1 C4.1 C5.1 C6.1 C7.2 C8.1 C9.1 C10.1 C11.1 C12.2 CN1.1(-) CN2.1(-) CN3.2 H3.5 H3.6 H4.7 H4.8 H5.3 H5.4 J1.4 J1.14 J2.2 LED1.1(K) LED2.1(K) Q2.2(E) R1.1 R5.1 R8.1 R10.2 R13.2 U5.1(GND) U5.3(GND) U6.0(EP/GND) U6.7(GND) U8.2(GND) U9.1(-) U10.2 U21.2 U22.2 U23.2 U24.2
VCC: CN1.2(+) CN2.2(+) D1.1(A) Q1.2(D) R9.1
00.0: J1.1 U5.99(00.0)
00.1: J1.3 U5.100(00.1)
00.2: J1.5 U5.101(00.2)
00.3: J1.7 U5.102(00.3)
00.4: J1.9 U5.103(00.4)
00.5: J1.11 U5.104(00.5)
00.6: J1.13 U5.105(00.6)
00.7: J1.15 U5.106(00.7)
00.8: U5.107(00.8)
00.9: U5.108(00.9)
00.12: U5.109(00.12)
02.0: J1.12 U5.90(02.0)
02.1: J1.2 U5.91(02.1)
02.2: J1.8 U5.92(02.2)
02.3: J1.6 U5.93(02.3)
02.4: U5.94(02.4)
02.5: U5.95(02.5)
02.6: U5.96(02.6)
02.7: U5.97(02.7)
02.8: U5.98(02.8)
10.1: U5.85(10.1)
10.2: H3.4 U5.86(10.2)
10.3: U5.87(10.3)
10.5: H3.1 U5.88(10.5)
10.6: H3.3 U5.89(10.6)
11.2: R32.2 U5.78(11.2)
11.3: R33.2 U5.79(11.3)
11.6: H3.8 U5.80(11.6)
11.9: J2.1 U5.81(11.9)
11.10: J2.3 U5.82(11.10)
11.11: J2.5 U5.83(11.11)
11.12: J2.7 U5.84(11.12)
13.0: J2.9 U5.74(13.0)
13.1: J2.11 U5.75(13.1)
13.2: J2.13 U5.76(13.2)
13.3: J2.15 U5.77(13.3)
14.0: U5.67(14.0)
14.1: U5.68(14.1)
14.2: U5.69(14.2)
14.3: U5.70(14.3)
14.4: U5.71(14.4)
14.5: U5.72(14.5)
14.6: U5.73(14.6)
15.0: J2.12 U5.58(15.0)
15.1: J2.10 U5.59(15.1)
15.2: J2.14 U5.60(15.2)
15.3: J2.6 U5.61(15.3)
15.4: J2.16 U5.62(15.4)
15.5: J2.8 U5.63(15.5)
15.6: CN3.4 U5.64(15.6)
15.7: CN3.3 U5.65(15.7)
15.8: H4.6 U5.66(15.8)
20.0: U5.44(20.0)
20.2: U5.45(20.2)
20.3: U5.46(20.3)
20.6: R30.2 U5.49(20.6)
20.7: R31.2 U5.50(20.7)
20.8: U5.51(20.8)
20.9: U5.52(20.9)
20.10: U5.53(20.10)
20.11: U5.54(20.11) U10.3
20.12: U5.55(20.12) U10.5
20.13: U5.56(20.13) U10.6
20.14: U5.57(20.14) U10.4
21.2: R34.1 U5.38(21.2)
21.3: R36.2 U5.39(21.3)
21.4: R35.1 U5.40(21.4)
21.5: R37.2 U5.41(21.5)
21.6: U5.42(21.6)
21.7: U5.43(21.7)
22.0: H4.5 U5.34(22.0)
22.1: H4.1 U5.35(22.1)
22.2: H4.4 U5.36(22.2)
22.3: H4.3 U5.37(22.3)
23.1: H4.10 U5.33(23.1)
32.4: U5.32(32.4)
33.4: U5.22(33.4)
33.5: U5.23(33.5)
33.6: U5.24(33.6)
33.7: U5.25(33.7)
33.8: U5.26(33.8)
33.9: U5.27(33.9)
33.10: R12.1 R13.1 U5.28(33.10)
33.11: U5.29(33.11)
33.12: U5.30(33.12)
33.13: U5.31(33.13)
A0: U5.21(A0)
A1: U5.20(A1)
A2: U5.19(A2)
A3: U5.18(A3)
A4: U5.17(A4)
A5: U5.16(A5)
A6: U5.15(A6)
A7: U5.14(A7)
A8: U5.13(A8)
A10: U5.12(A10)
A11: C12.1 R9.2 R10.1 U5.11(A11)
A12: U5.10(A12)
A13: U5.9(A13)
A16: U5.8(A16)
A17: U5.7(A17)
A20: U5.6(A20)
A21: U5.5(A21)
A48: U5.111(A48)
A49: U5.110(A49)
ESR0: U5.48(ESR0)
ESR1: U5.47(ESR1)
$1N3689: C1.1 U6.1(BOOT)
$1N3695: C1.2 L1.1 U6.8(SW)
$1N3701: C2.1 C3.2 C4.2 D1.2(K) U6.2(VIN) U6.3(EN)
$1N4253: R1.2 U6.4(RT/CLK)
$1N4305: R2.2 U6.6(COMP)
$1N4403: C5.2 R2.1
$1N4480: C6.2 C7.1 D2.1(A) L1.2
$1N4838: R3.1 R4.2
$1N4842: R4.1 R5.2 U6.5(FB)
$1N5194: LED1.2(A) R6.1
$1N5860: LED2.2(A) R7.2
$1N5984: D3.1(K) Q1.3(S) SW12.1 U9.2(+)
$1N6140: D3.2(A) R8.2 SW12.3
$1N6807: Q1.1(G) SW12.2
$1N8656: BUZZER1.1(+) R11.2
$1N8703: BUZZER1.2 Q2.3(C)
$1N8826: Q2.1(B) R12.2
$1N25852: R24.2 R30.1 U21.1
$1N25895: R25.2 R31.1 U22.1
$1N25944: R26.2 R32.1 U23.1
$1N25995: R27.2 R33.1 U24.1
$1N43385: H5.1 R35.2
$1N43389: H5.2 R34.2
$1N43393: H5.6 R36.1
$1N43397: H5.5 R37.1

Not connected (* = marked no-connect by the designer): CN1 3 4; CN2 3 4; H3 2*; H4 2*; J1 10*; SCREW1 1; SCREW2 1; SCREW3 1; SCREW4 1; SCREW5 1; SCREW6 1; SCREW7 1; SCREW8 1; U5 112(A47) 113(A46) 114(A45) 115(A44) 116(A39) 117(A38) 118(A37) 119(A36) 120(A35) 121(A25) 122(A24); U8 4(NC)*; U10 7* 8*

## Notes on the sheet
- SPI
- 核心板
- 无线串口
- 开关
- 摄像头接口
- 舵机信号接口
- 屏幕接口
- 姿态传感
- 5V电源
- 定位模块接口
- 3v电源
- 电源开关
- 定位孔
- 电机舵机电源接口
- 电压测量
- 蜂鸣器

# Board PCB1
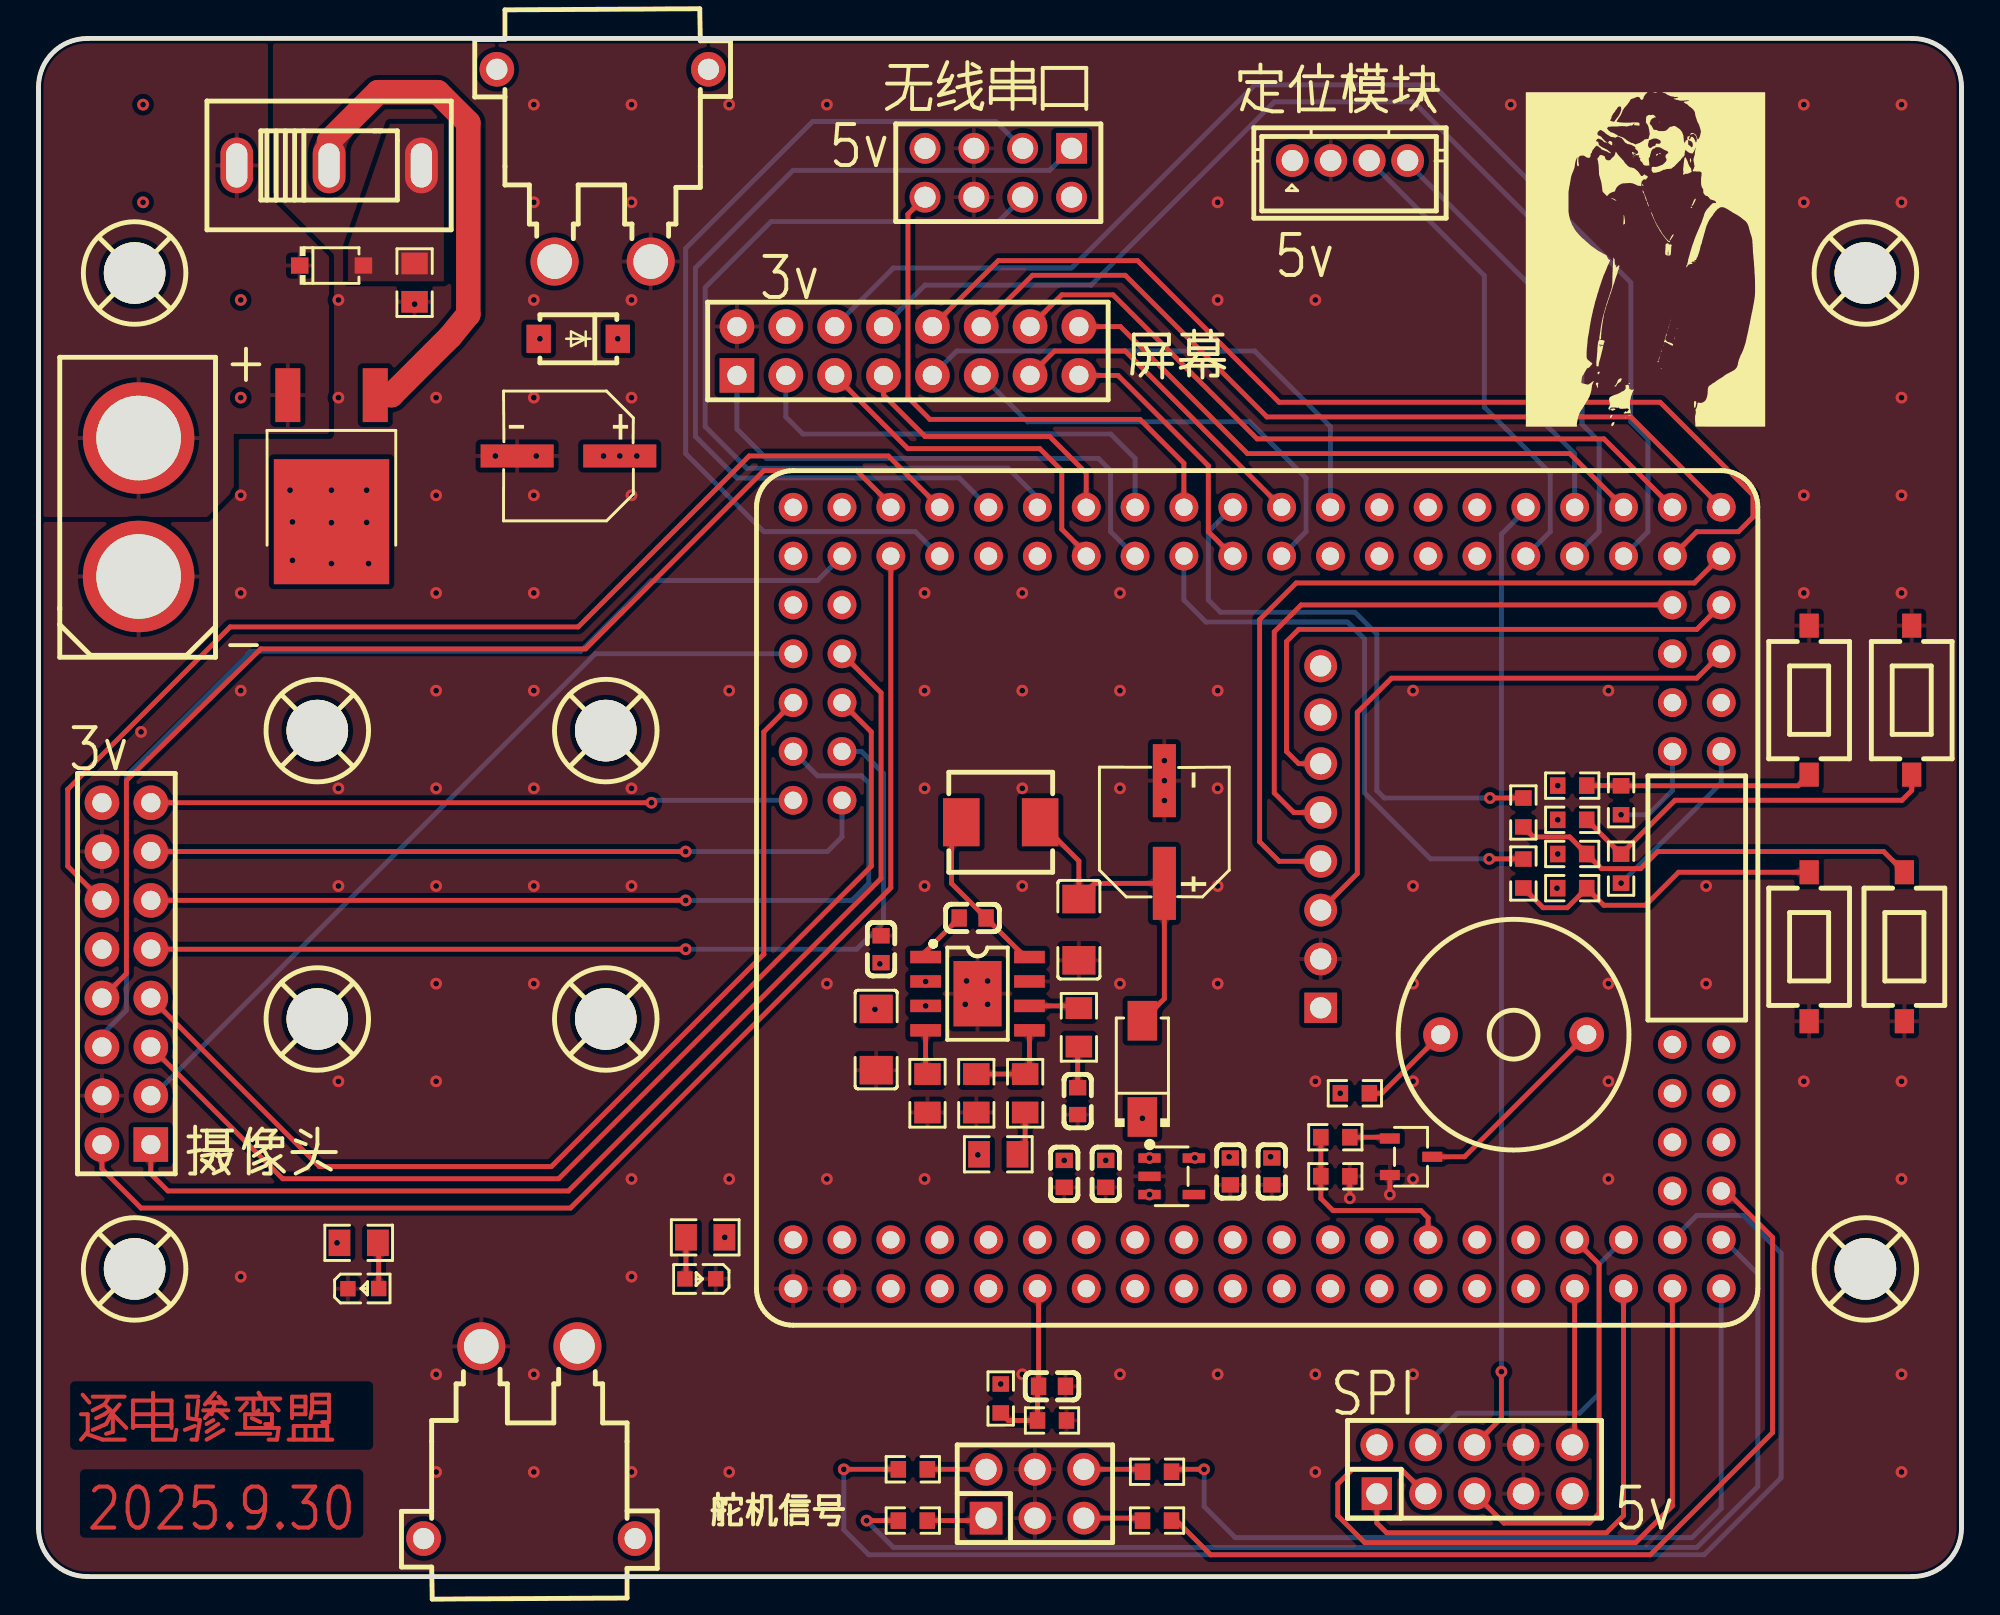
[diagram p1: board, top side]
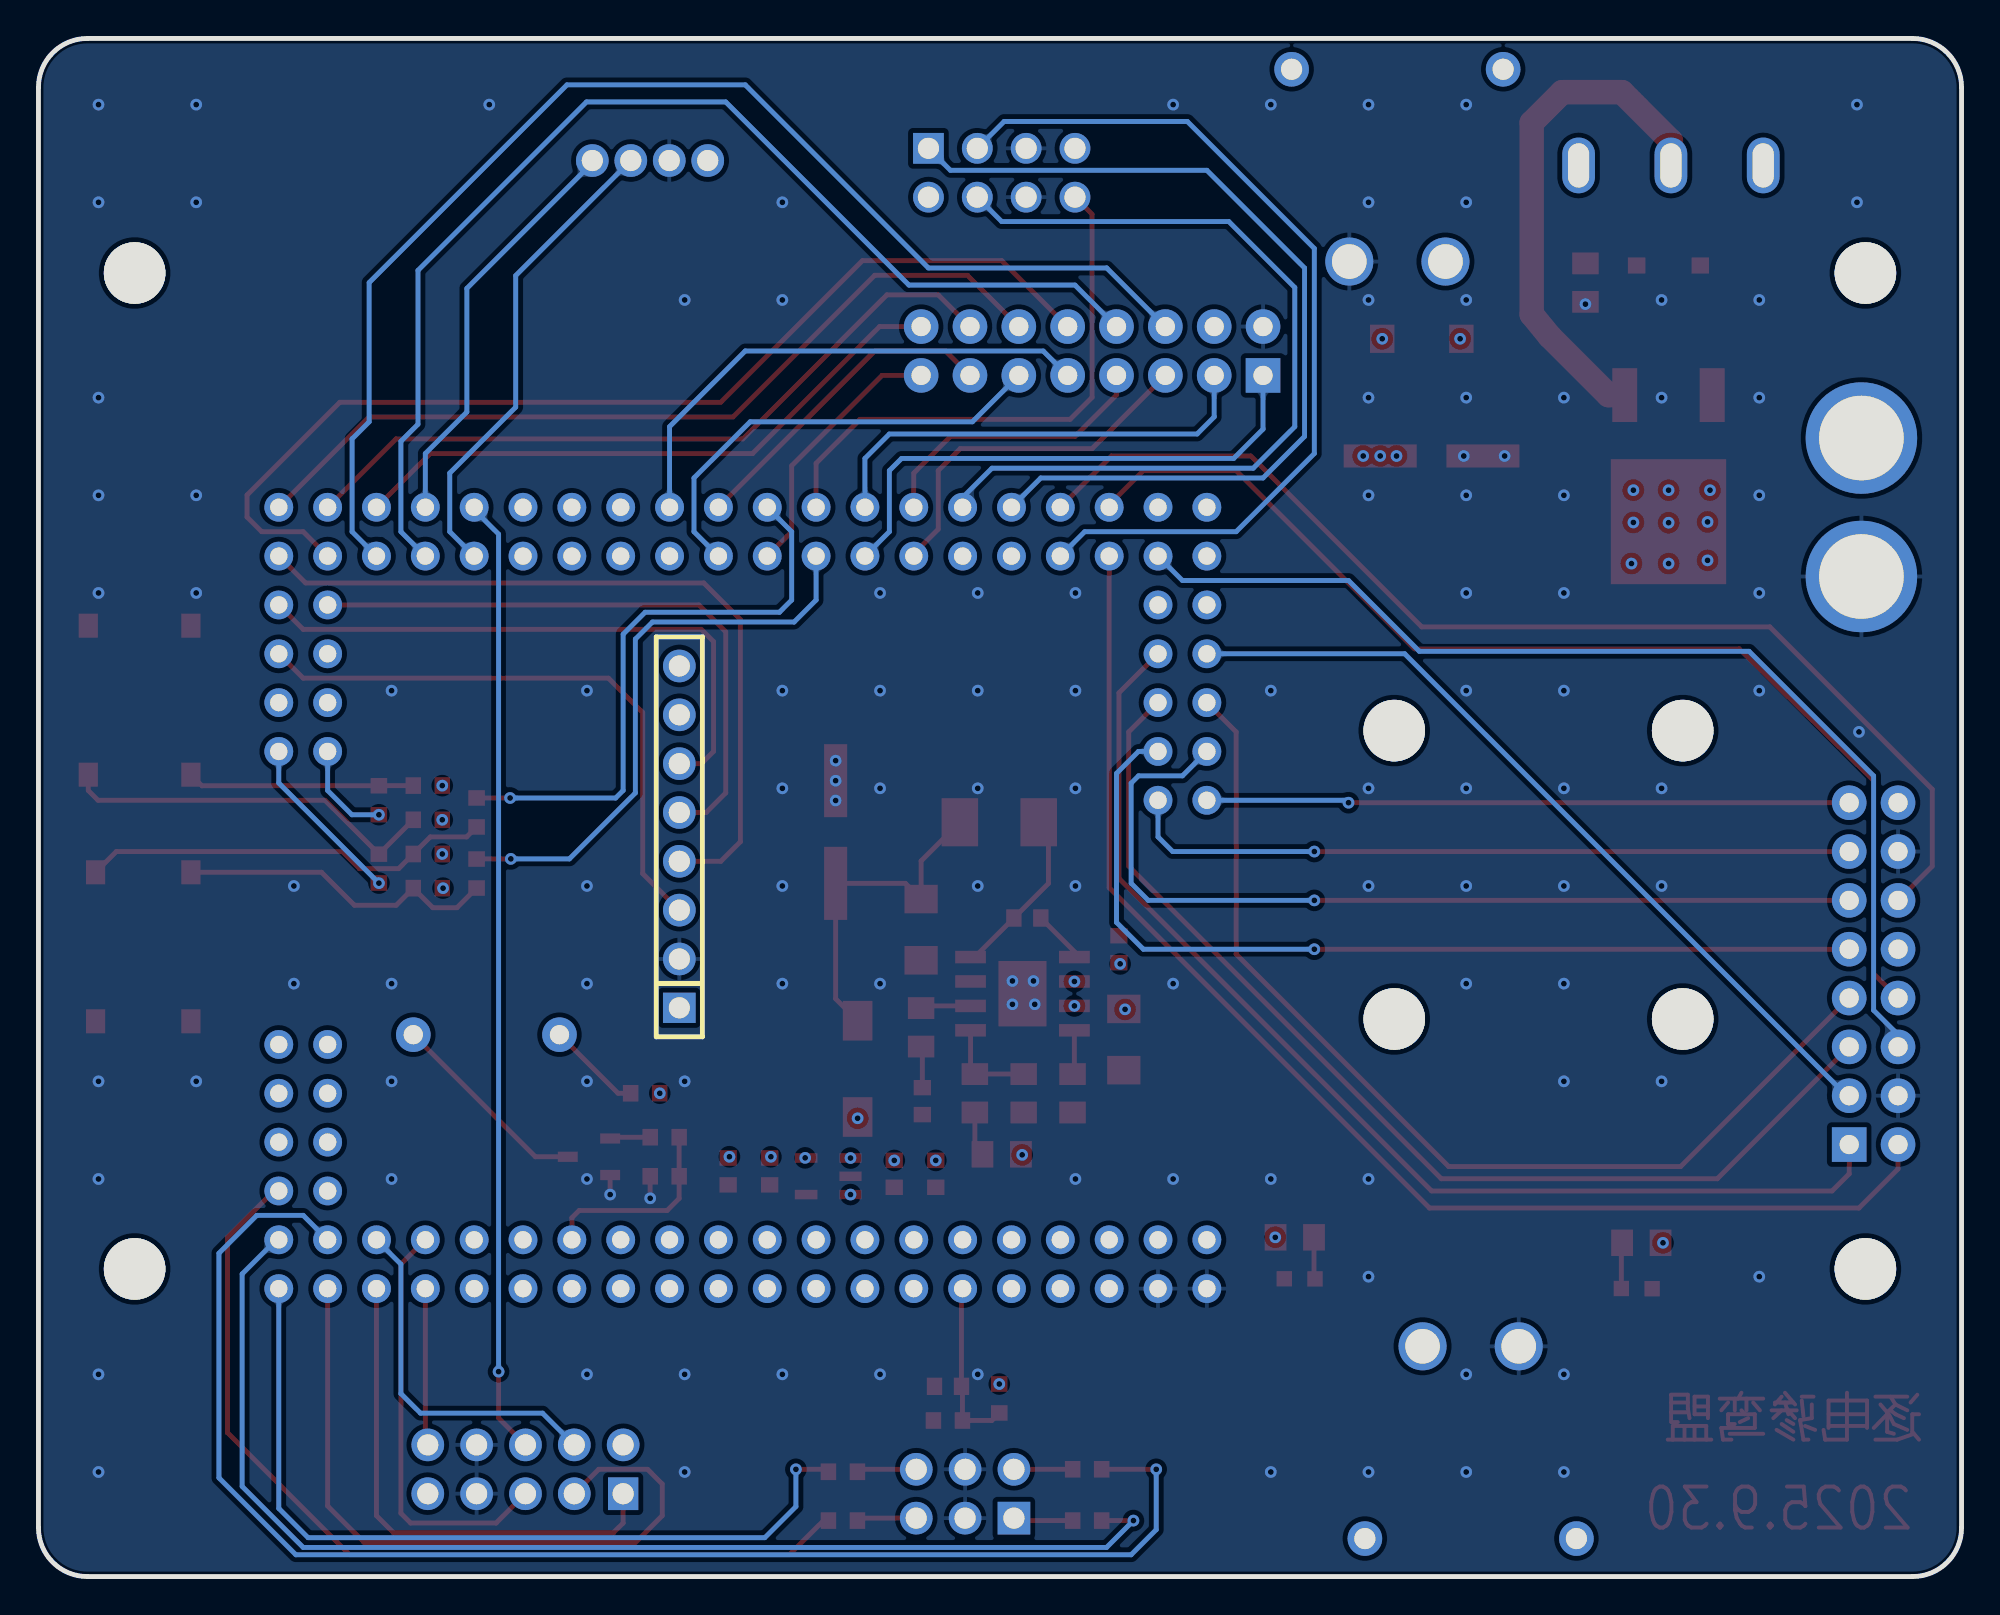
[diagram p2: board, bottom side, seen from below]

Outline 100 x 80 mm; copper layers: Top Layer, Inner1, Inner2, Bottom Layer. Coordinates in mm from the lower left corner of the outline.
Outline path: 0,77.46 0,2.54 arc(0.74,0.74) 2.54,0 97.46,0 arc(99.26,0.74) 100,2.54 100,77.46 arc(99.26,79.26) 97.46,80 2.54,80 arc(0.74,79.26) 0,77.46
Stack: Top Layer 0.035mm 外层铜厚1oz / Dielectric1 0.2104mm 7628 RC49% 8.6mil / Inner1 0.0152mm 内层铜厚 / Dielectric2 1.065mm 1.1mm H/HOZ Copper / Inner2 0.0152mm 内层铜厚 / Dielectric3 0.2104mm 7628 RC49% 8.6mil / Bottom Layer 0.035mm 外层铜厚1oz

## Design rules (mm)
template: JLCPCB Capability(Two Layers Board)
spacing copperThickness1oz (default): track to track 0.102, other pairs 0.152 to 0.3
spacing copperThickness2oz: track to track 0.203, other pairs 0.152 to 0.3
track width copperThickness1oz (default): min 0.127, default 0.254, max 2.54
track width copperThickness2oz: min 0.203, default 0.254, max 2.54
differential pair differentialPair (default): width min 0.127, default 0.254, max 2.54; gap min 0.152, default 0.152
via viaSize (default): diameter min 0.5, default 0.61, max 10; hole min 0.3, default 0.305, max 6.3

## Placement (name value [footprint] x y rotation side)
BUZZER1  2.3kHz  [BUZ-TH_BD12.0-P7.60-D0.6-FD]  76.71 28.18 0 top
C1  100nF  [C0603]  48.58 34.25 0 top
C2  100uF  [CAP-SMD_BD6.3-L6.6-W6.6-FD-1]  27.56 58.28 180 top
C3  4.7uF  [C1206]  43.56 27.93 90 top
C4  100nF  [C0603]  43.81 32.63 270 top
C5  4.7nF  [C0603]  54.04 24.73 90 top
C6  47uF  [C1206]  54.1 33.64 90 top
C7  220uF  [CAP-SMD_BD6.3-L6.6-W6.6-FD-1]  58.55 38.72 90 top
C8  10uF  [C0603]  53.34 20.94 90 top
C9  100nF  [C0603]  55.5 20.94 90 top
C10  10uF  [C0603]  61.98 21.07 90 top
C11  100nF  [C0603]  64.13 21.07 90 top
C12  100nF  [C0603]  52.71 9.9 0 top
CN1  XT30PW-M30.G.Y  [CONN-TH_XT30PW-M]  29.34 73.4 180 top
CN2  XT30PW-M30.G.Y  [CONN-TH_XT30PW-M]  25.53 6.97 0 top
CN3  WAFER-PH2.0-4PZZ  [CONN-TH_4P-P2.00_FWF20001-S04S22W5B]  68.2 73.65 0 top
D1  SS54  [footprint_93fc]  28.07 64.38 0 top
D2  SS54  [SMA_L4.4-W2.8-LS5.4-R-RD]  57.4 26.41 90 top
D3  BZT52C16  [SOD-123_L2.7-W1.7-LS3.8-RD]  15.24 68.19 0 top
H3  DS1023-2*4SF11  [HDR-TH_8P-P2.54-V-F-R2-C4-S2.54]  49.91 73.02 180 top
H4  PM254V-12-10P-H85  [HDR-TH_10P-P2.54-V-F-R2-C5-S2.54]  74.68 5.58 0 top
H5  PZ254V-12-6P  [HDR-TH_6P-P2.54-V-M-R2-C3-S2.54]  51.82 4.31 0 top
J1  2.54-2*8P母  [HDR-TH_16P-P2.54-V-F-R2-C8-S2.54]  4.57 31.36 90 top
J2  2.54-2*8P母  [HDR-TH_16P-P2.54-V-F-R2-C8-S2.54]  45.21 63.74 0 top
L1  4.7uH  [IND-SMD_L5.4-W5.2_FXL0530]  50.04 39.23 0 top
LED1  XL-1608UBC-04  [LED0603-RD_BLUE]  34.42 15.48 180 top
LED2  XL-1608UBC-04  [LED0603-RD_BLUE]  16.89 14.98 0 top
Q1  HY19P03D  [TO-252-2_L6.6-W6.1-P4.57-LS9.9-TL-CW]  15.24 58.16 270 top
Q2  S8050  [SOT-23-3_L3.0-W1.7-P0.95-LS2.9-BR]  71.37 21.83 180 top
R1  200kΩ  [R0805]  46.23 25.14 90 top
R2  20kΩ  [R0805]  54.1 28.56 90 top
R3  51kΩ  [R0805]  49.91 21.96 180 top
R4  1.5kΩ  [R0805]  51.31 25.14 270 top
R5  10kΩ  [R0805]  48.77 25.14 90 top
R6  4.7kΩ  [R0805]  34.67 17.64 0 top
R7  2.7kΩ  [R0805]  16.65 17.36 0 top
R8  10kΩ  [R0805]  19.56 67.3 90 top
R9  200kΩ  [R0603]  50.04 9.26 270 top
R10  20kΩ  [R0603]  52.71 8.12 0 top
R11  10Ω  [R0603]  68.45 25.14 0 top
R12  4.7kΩ  [R0603]  67.44 22.85 0 top
R13  1kΩ  [R0603]  67.44 20.82 0 top
R24  4.7kΩ  [R0603]  79.76 41.14 0 top
R25  4.7kΩ  [R0603]  79.76 39.36 0 top
R26  4.7kΩ  [R0603]  79.76 37.58 0 top
R27  4.7kΩ  [R0603]  79.76 35.8 0 top
R30  470Ω  [R0603]  82.3 40.38 270 top
R31  470Ω  [R0603]  82.3 36.82 270 top
R32  470Ω  [R0603]  77.22 39.74 90 top
R33  470Ω  [R0603]  77.22 36.57 90 top
R34  100Ω  [R0603]  45.47 5.58 0 top
R35  100Ω  [R0603]  45.47 2.91 0 top
R36  100Ω  [R0603]  58.17 5.45 0 top
R37  100Ω  [R0603]  58.17 2.91 0 top
SCREW1  -  [M3螺丝]  95 67.8 0 top
SCREW2  -  [M3螺丝]  5 16 0 top
SCREW3  -  [M3螺丝]  5 67.8 0 top
SCREW4  -  [M3螺丝]  95 16 0 top
SCREW5  -  [M3螺丝]  14.5 29 0 top
SCREW6  -  [M3螺丝]  14.5 44 0 top
SCREW7  -  [M3螺丝]  29.5 29 0 top
SCREW8  -  [M3螺丝]  29.5 44 0 top
SW12  SS12D10G4 071  [SW-TH_SHOU-HAN_SS12D10G4]  15.11 73.4 0 top
U5  TC264_CoreBoard  [TC264_main]  39.24 14.98 90 top
U6  SP1N28STER  [SOP-8E]  48.83 30.32 0 top
U8  RT9013-33GB  [SOT-23-5_L3.0-W1.7-P0.95-LS2.8-BL]  58.93 20.82 270 top
U9  XT60-M.  [CONN-TH_XT60]  5.21 55.62 90 top
U10  PM254-1-08-Z-8.5  [HDR-TH_8P-P2.54-V-F]  66.68 38.47 90 bottom
U21  GT-TC060A-H025-L1  [SW-SMD_L6.1-W3.5-LS8.0]  92.07 45.58 90 top
U22  GT-TC060A-H025-L1  [SW-SMD_L6.1-W3.5-LS8.0]  97.41 45.58 90 top
U23  GT-TC060A-H025-L1  [SW-SMD_L6.1-W3.5-LS8.0]  97.03 32.76 270 top
U24  GT-TC060A-H025-L1  [SW-SMD_L6.1-W3.5-LS8.0]  92.07 32.76 270 top

## Footprints (pads in the part's own frame, mm; a bottom-side part is the same pattern mirrored in y, then rotated)
BUZ-TH_BD12.0-P7.60-D0.6-FD
  round 1.8 hole 1: 1(-3.8,0) 2(3.8,0)
C0603
  rect 0.8x0.9 smd: 1(-0.7,0) 2(0.7,0)
C1206
  rect 1.485x1.728 smd: 1(-1.593,0) 2(1.593,0)
CAP-SMD_BD6.3-L6.6-W6.6-FD-1
  rect 3.8x1.2 smd: 1(-2.67,0) 2(2.67,0)
CONN-TH_4P-P2.00_FWF20001-S04S22W5B
  round 1.7 hole 1.1: 1(-3,0) 2(-1,0) 3(1,0) 4(3,0)
CONN-TH_XT30PW-M
  round 2.5 hole 1.8: 1(-2.5,5) 2(2.5,5)
  round 1.8 hole 1.1: 3(5.5,-5) 4(-5.5,-5)
CONN-TH_XT60
  round 5.8 hole 4.4: 1(-3.6,0) 2(3.6,0)
footprint_93fc
  rect 1.27x1.47 smd: 1(-2.058,0) 2(2.058,0)
HDR-TH_6P-P2.54-V-M-R2-C3-S2.54
  rect 1.7x1.7 hole 1.1: 1(-2.54,-1.27)
  round 1.7 hole 1.1: 2(-2.54,1.27) 3(0,-1.27) 4(0,1.27) 5(2.54,-1.27) 6(2.54,1.27)
HDR-TH_8P-P2.54-V-F
  rect 1.575x1.7 hole 1.1: 1(-8.89,0)
  round 1.7 hole 1.1: 2(-6.35,0) 3(-3.81,0) 4(-1.27,0) 5(1.27,0) 6(3.81,0) 7(6.35,0) 8(8.89,0)
HDR-TH_8P-P2.54-V-F-R2-C4-S2.54
  rect 1.6x1.6 hole 1.1: 1(-3.81,-1.27)
  round 1.6 hole 1.1: 2(-3.81,1.27) 3(-1.27,-1.27) 4(-1.27,1.27) 5(1.27,-1.27) 6(1.27,1.27) 7(3.81,-1.27) 8(3.81,1.27)
HDR-TH_10P-P2.54-V-F-R2-C5-S2.54
  rect 1.575x1.7 hole 1.1: 1(-5.08,-1.27)
  round 1.7 hole 1.1: 2(-5.08,1.27) 3(-2.54,-1.27) 4(-2.54,1.27) 5(0,-1.27) 6(0,1.27) 7(2.54,-1.27) 8(2.54,1.27) 9(5.08,-1.27) 10(5.08,1.27)
HDR-TH_16P-P2.54-V-F-R2-C8-S2.54
  rect 1.8x1.8 hole 1: 1(-8.89,-1.27)
  round 1.8 hole 1: 2(-8.89,1.27) 3(-6.35,-1.27) 4(-6.35,1.27) 5(-3.81,-1.27) 6(-3.81,1.27) 7(-1.27,-1.27) 8(-1.27,1.27) 9(1.27,-1.27) 10(1.27,1.27) 11(3.81,-1.27) 12(3.81,1.27) 13(6.35,-1.27) 14(6.35,1.27) 15(8.89,-1.27) 16(8.89,1.27)
IND-SMD_L5.4-W5.2_FXL0530
  rect 1.9x2.5 smd: 1(-2.05,0) 2(2.05,0)
LED0603-RD_BLUE
  rect 0.8x0.8 smd: 1(-0.799,-0.004) 2(0.799,0.004)
M3螺丝
  round 3.2 hole 3.2: 1(0,0)
R0603
  rect 0.806x0.864 smd: 1(-0.753,0) 2(0.753,0)
R0805
  rect 1.133x1.377 smd: 1(-1,0) 2(1,0)
SMA_L4.4-W2.8-LS5.4-R-RD
  rect 2.062x1.539 smd: 1(2.503,0) 2(-2.503,0)
SOD-123_L2.7-W1.7-LS3.8-RD
  rect 0.91x0.84 smd: 1(-1.655,0) 2(1.655,0)
SOP-8E
  rect 2.5x3.4 smd: 0(0,0)
  rect 1.6x0.65 smd: 1(-2.7,1.905) 2(-2.7,0.635) 3(-2.7,-0.635) 4(-2.7,-1.905) 5(2.7,-1.905) 6(2.7,-0.635) 7(2.7,0.635) 8(2.7,1.905)
SOT-23-3_L3.0-W1.7-P0.95-LS2.9-BR
  rect 1.038x0.532 smd: 1(1.101,-0.95) 2(1.101,0.95) 3(-1.101,0)
SOT-23-5_L3.0-W1.7-P0.95-LS2.8-BL
  rect 0.49x1.157 smd: 1(-0.95,-1.153) 2(0,-1.153) 3(0.95,-1.153)
  rect 0.49x1.175 smd: 4(0.95,1.153) 5(-0.95,1.153)
SW-SMD_L6.1-W3.5-LS8.0
  rect 1.25x1 smd: 1(-3.875,0) 2(3.875,0)
SW-TH_SHOU-HAN_SS12D10G4
  oval 1.7x2.9 hole 1.1x2.3: 1(-4.8,0) 2(0,0) 3(4.8,0)
TC264_main
  round 1.5 hole 0.9: 1(0,0) 2(2.54,0) 3(0,-2.54) 4(2.54,-2.54) 5(0,-5.08) 6(2.54,-5.08) 7(0,-7.62) 8(2.54,-7.62) 9(0,-10.16) 10(2.54,-10.16) 11(0,-12.7) 12(2.54,-12.7) 13(0,-15.24) 14(2.54,-15.24) 15(0,-17.78) 16(2.54,-17.78) 17(0,-20.32) 18(2.54,-20.32) 19(0,-22.86) 20(2.54,-22.86) 21(0,-25.4) 22(2.54,-25.4) 23(0,-27.94) 24(2.54,-27.94) 25(0,-30.48) 26(2.54,-30.48) 27(0,-33.02) 28(2.54,-33.02) 29(0,-35.56) 30(2.54,-35.56) 31(0,-38.1) 32(2.54,-38.1) 33(0,-40.64) 34(2.54,-40.64) 35(0,-43.18) 36(2.54,-43.18) 37(0,-45.72) 38(2.54,-45.72) 39(0,-48.26) 40(2.54,-48.26) 41(5.08,-48.26) 42(5.08,-45.72) 43(7.62,-48.26) 44(7.62,-45.72) 45(10.16,-48.26) 46(10.16,-45.72) 47(12.7,-48.26) 48(12.7,-45.72) 49(27.94,-45.72) 50(27.94,-48.26) 51(30.48,-45.72) 52(30.48,-48.26) 53(33.02,-45.72) 54(33.02,-48.26) 55(35.56,-45.72) 56(35.56,-48.26) 57(38.1,-48.26) 58(40.64,-48.26) 59(38.1,-45.72) 60(40.64,-45.72) 61(38.1,-43.18) 62(40.64,-43.18) 63(38.1,-40.64) 64(40.64,-40.64) 65(38.1,-38.1) 66(40.64,-38.1) 67(38.1,-35.56) 68(40.64,-35.56) 69(38.1,-33.02) 70(40.64,-33.02) 71(38.1,-30.48) 72(40.64,-30.48) 73(38.1,-27.94) 74(40.64,-27.94) 75(38.1,-25.4) 76(40.64,-25.4) 77(38.1,-22.86) 78(40.64,-22.86) 79(38.1,-20.32) 80(40.64,-20.32) 81(38.1,-17.78) 82(40.64,-17.78) 83(38.1,-15.24) 84(40.64,-15.24) 85(38.1,-12.7) 86(40.64,-12.7) 87(38.1,-10.16) 88(40.64,-10.16) 89(38.1,-7.62) 90(40.64,-7.62) 91(38.1,-5.08) 92(40.64,-5.08) 93(38.1,-2.54) 94(40.64,-2.54) 95(38.1,0) 96(40.64,0) 97(35.56,-2.54) 98(35.56,0) 99(33.02,-2.54) 100(33.02,0) 101(30.48,-2.54) 102(30.48,0) 103(27.94,-2.54) 104(27.94,0) 105(25.4,-2.54) 106(25.4,0)
TO-252-2_L6.6-W6.1-P4.57-LS9.9-TL-CW
  rect 2.8x1.3 smd: 1(-3.292,2.273) 3(-3.292,-2.273)
  rect 6.5x6 smd: 2(3.292,0)

## Nets
As in the schematic.

Pads without a net: CN1 3 4; CN2 3 4; H3 2; H4 2; J1 10; SCREW1 1; SCREW2 1; SCREW3 1; SCREW4 1; SCREW5 1; SCREW6 1; SCREW7 1; SCREW8 1; U8 4; U10 7 8

## Via types
v1: diameter 0.61, hole 0.305, Top Layer to Bottom Layer, 165 vias

## Routing (per net, layer and track width the routed paths; a pad name or vN(x,y) marks a point on that pad's centre or on a via; arc(x,y) is an arc through that point)
3V: length 82.8
  Inner2 w1.27: J1.16 3.3,41.01 4.57,42.28 7.87,42.28 10.03,40.12 10.03,22.85 v1(15.52,17.36) 24.44,26.28 60.71,26.28
  vias: v1(60.13,21.78) v1(61.91,21.83) v1(64.07,21.83) v1(67.69,25.14) v1(79,41.14) v1(79,39.36) v1(79,37.58) v1(78.96,35.8)
+5V: length 154
  Inner2 w2.032: 57.15,12.44 67.82,1.77 78.78,1.77 79.76,2.74 H4.9 88.65,4.31 91.31,6.97 91.31,22.34 94.74,25.77 94.74,57.9 88.52,64.12 71.71,64.12 65.07,70.76 65.07,73.65 ; H3.7 46.1,75.68 47.24,76.83 61.88,76.83 65.05,73.65
  vias: v1(35.69,17.64) v1(48.85,21.93) v1(53.34,21.65) v1(55.5,21.65) v1(57.4,23.84) v1(57.77,21.77) v1(57.77,19.87)
GND: length 2.2
  Top Layer w0.254: v1(70.27,19.87) Q2.2 ; v1(68.19,19.68) R13.2
  vias: v1(5.33,43.93) v1(5.44,76.56) v1(5.44,71.48) v1(10.52,66.4) v1(10.52,61.32) v1(10.52,56.24) v1(10.52,51.16) v1(10.52,46.08) v1(10.52,15.6) v1(15.6,66.4) v1(15.6,61.32) v1(15.6,41) v1(15.6,35.92) v1(15.6,25.76) v1(19.56,66.18) v1(20.68,61.32) v1(20.68,56.24) v1(20.68,51.16) v1(20.68,46.08) v1(20.68,41) v1(20.68,35.92) v1(20.68,30.84) v1(20.68,25.76) v1(20.68,10.52) v1(20.68,5.44) v1(23.76,58.28) v1(25.76,76.56) v1(25.76,71.48) v1(25.76,66.4) v1(25.76,61.32) v1(25.76,56.24) v1(25.76,51.16) v1(25.76,46.08) v1(25.76,41) v1(25.76,35.92) v1(25.76,30.84) v1(25.76,10.52) v1(25.76,5.44) v1(25.89,58.28) v1(30.84,76.56) v1(30.84,71.48) v1(30.84,66.4) v1(30.84,61.32) v1(30.84,56.24) v1(30.84,41) v1(30.84,35.92) v1(30.84,20.68) v1(30.84,15.6) v1(30.84,5.44) v1(35.92,76.56) v1(35.92,46.08) v1(35.92,20.68) v1(35.92,5.44) v1(41,76.56) v1(41,30.84) v1(41,20.68) v1(46.08,51.16) v1(46.08,46.08) v1(46.08,41) v1(46.08,35.92) v1(46.08,20.68) v1(48.19,29.76) v1(48.26,30.98) v1(49.35,30.98) v1(49.35,29.76) v1(51.16,51.16) v1(51.16,46.08) v1(51.16,41) v1(51.16,35.92) v1(51.16,10.52) v1(56.24,51.16) v1(56.24,46.08) v1(56.24,41) v1(56.24,30.84) v1(56.24,10.52) v1(58.55,42.44) v1(58.55,41.39) v1(58.55,40.36) v1(61.32,71.48) v1(61.32,66.4) v1(61.32,46.08) v1(61.32,41) v1(61.32,35.92) v1(61.32,30.84) v1(61.32,10.52) v1(66.4,66.4) v1(66.4,25.76) v1(66.4,10.52) v1(66.4,5.44) v1(71.48,46.08) v1(71.48,35.92) v1(71.48,30.84) v1(71.48,25.76) v1(71.48,20.68) v1(71.48,10.52) v1(76.56,76.56) v1(81.64,46.08) v1(81.64,30.84) v1(81.64,25.76) v1(81.64,20.68) v1(86.72,35.92) v1(86.72,30.84) v1(91.8,76.56) v1(91.8,71.48) v1(91.8,56.24) v1(91.8,51.16) v1(91.8,25.76) v1(96.88,76.56) v1(96.88,71.48) v1(96.88,61.32) v1(96.88,56.24) v1(96.88,51.16) v1(96.88,25.76) v1(96.88,20.68) v1(96.88,10.52) v1(96.88,5.44)
VCC: length 93.5
  Inner2 w1.524: v1(50.04,10.01) 29.86,10.01 24.77,15.1 13.59,15.1 8.89,19.8 2.41,19.8 1.14,21.07 1.14,42.92 4.06,45.84 8.38,45.84 v1(15.23,52.69)
  vias: v1(13.08,56.5) v1(13.21,54.85) v1(13.21,52.85) v1(15.23,56.5) v1(15.23,54.81) v1(17.06,56.5) v1(17.06,54.83) v1(17.17,52.69) v1(26.08,64.38)
00.0: length 59.1
  Top Layer w0.254: U5.99 43.81,45.96 43.81,36.31 27.56,20.06 6.73,20.06 5.84,20.94 J1.1
00.1: length 42.9
  Bottom Layer w0.254: J1.3 5.97,25.01 28.96,48 U5.100
00.2: length 56.2
  Top Layer w0.254: U5.101 43.31,43.93 43.31,36.95 27.05,20.69 12.7,20.69 J1.5
00.3: length 53.8
  Top Layer w0.254: J1.7 14.61,21.33 26.67,21.33 37.72,32.38 37.72,43.93 U5.102
00.4: length 49.1
  Top Layer w0.254: J1.9 v1(33.66,32.63)
  Bottom Layer w0.254: U5.103 42.8,42.92 43.94,41.77 43.94,34.03 42.54,32.63 v1(33.66,32.63)
00.5: length 47.5
  Top Layer w0.254: J1.11 v1(33.66,35.17)
  Bottom Layer w0.254: U5.104 40.51,41.65 42.8,41.65 43.18,41.27 43.18,36.06 42.29,35.17 v1(33.66,35.17)
00.6: length 38.2
  Top Layer w0.254: J1.13 v1(33.66,37.71)
  Bottom Layer w0.254: v1(33.66,37.71) 41.02,37.71 41.78,38.47 U5.105
00.7: length 33.5
  Top Layer w0.254: v1(31.88,40.25) J1.15
  Bottom Layer w0.254: v1(31.88,40.25) 32,40.38 U5.106
02.0: length 60.1
  Top Layer w0.254: U5.90 44.2,58.28 36.96,58.28 28.07,49.39 9.97,49.39 1.52,40.95 1.52,36.95 J1.12
02.1: length 67.3
  Top Layer w0.254: J1.2 3.3,21.2 5.33,19.17 27.66,19.17 44.32,35.83 U5.91
02.2: length 59.1
  Top Layer w0.254: J1.8 4.57,31.36 4.57,41.4 11.56,48.25 28.45,48.25 37.72,57.52 42.54,57.52 44.32,55.74 U5.92
02.3: length 56.9
  Bottom Layer w0.254: U5.93 40.51,51.81 31.88,51.81 28.19,48.12 11.05,48.12 4.57,41.65 4.57,29.45 2.92,27.8 2.92,27.42
10.2: length 45
  Bottom Layer w0.254: H3.4 49.91,70.47 38.1,70.47 34.67,67.05 34.67,59.81 36.83,57.65 50.42,57.65 51.94,56.12 51.94,55.62
10.5: length 47.7
  Bottom Layer w0.254: U5.88 47.88,57.14 36.32,57.14 34.16,59.3 34.16,68.06 39.24,73.14 52.58,73.14 H3.1
10.6: length 46.9
  Bottom Layer w0.254: U5.89 45.59,54.35 37.72,54.35 33.66,58.41 33.66,69.08 40.26,75.68 49.78,75.68 H3.3
11.2: length 30.5
  Top Layer w0.254: R32.2 75.69,40.49
  Bottom Layer w0.254: U5.78 60.83,54.35 60.83,50.79 61.47,50.16 68.45,50.16 69.6,49.01 69.6,40.88 69.99,40.49 v1(75.47,40.49)
11.3: length 30.2
  Top Layer w0.254: v1(75.44,37.33) 77.21,37.33 R33.2
  Bottom Layer w0.254: v1(75.44,37.33) 72.39,37.33 68.96,40.76 68.96,48.76 68.07,49.65 60.71,49.65 59.56,50.79 U5.79
11.6: length 28.8
  Top Layer w0.254: U5.80 59.56,57.9 57.28,60.19 46.35,60.19 45.21,61.33 45.21,70.86 H3.8
11.9: length 28.1
  Bottom Layer w0.254: J2.1 36.32,59.68 37.85,58.16 55.12,58.16 55.75,57.52 55.75,54.35 U5.81
11.10: length 23.8
  Bottom Layer w0.254: J2.3 38.86,60.31 39.75,59.43 55.75,59.43 57.02,58.16 U5.82
11.11: length 18.8
  Top Layer w0.254: J2.5 45.21,58.66 52.07,58.66 53.21,57.52 53.21,54.47 54.48,53.2 U5.83
11.12: length 15
  Top Layer w0.254: J2.7 43.94,61.46 46.1,59.3 52.58,59.3 54.48,57.39 U5.84
13.0: length 27
  Bottom Layer w0.254: J2.9 47.75,63.74 63.25,63.74 67.18,59.81 U5.74
13.1: length 23.7
  Bottom Layer w0.254: J2.11 51.44,60.06 62.99,60.06 65.91,57.14 65.91,54.35 U5.75
13.2: length 17
  Top Layer w0.254: U5.76 56.51,63.74 52.83,63.74 J2.13
13.3: length 13.9
  Top Layer w0.254: J2.15 56.13,62.47 60.83,57.78 60.83,54.35 U5.77
15.0: length 44.6
  Top Layer w0.254: U5.58 82.8,60.31 63.88,60.31 56.51,67.68 51.69,67.68 J2.12
15.1: length 55.3
  Top Layer w0.254: U5.59 86.23,54.35 88.39,54.35 89.15,55.11 89.15,56.25 84.33,61.08 64.52,61.08 57.15,68.44 49.91,68.44 J2.10
15.2: length 38.7
  Top Layer w0.254: U5.60 81.41,59.17 63.37,59.17 55.88,66.67 53.21,66.67 J2.14
15.3: length 66
  Bottom Layer w0.254: U5.61 83.69,54.35 83.69,59.17 82.8,60.06 82.8,67.3 72.52,77.59 63.25,77.59 53.72,68.06 44.45,68.06 J2.6
15.4: length 32.2
  Top Layer w0.254: J2.16 56.26,65.01 62.87,58.41 79.63,58.41 U5.62
15.5: length 60.5
  Bottom Layer w0.254: 79.88,53.08 81.15,54.35 81.15,59.05 80.26,59.93 80.26,67.94 71.5,76.7 64.26,76.7 54.74,67.17 46.1,67.17 J2.8
15.6: length 21.7
  Bottom Layer w0.254: 79.88,55.62 79.88,58.41 77.72,60.57 77.72,67 71.07,73.65
15.7: length 25.1
  Bottom Layer w0.254: U5.65 78.61,54.35 78.61,57.39 75.18,60.82 75.18,67.67 CN3.3 69.07,73.65
15.8: length 49.9
  Top Layer w0.254: v1(76.07,10.66) 76.07,8.25 H4.6
  Bottom Layer w0.254: v1(76.07,10.66) 76.07,54.22 77.34,55.49 U5.66
20.6: length 5.2
  Bottom Layer w0.254: v1(82.3,39.62) 83.7,39.62 84.96,40.88 U5.49
20.7: length 9
  Bottom Layer w0.254: U5.50 87.5,41.27 v1(82.3,36.07)
20.11: length 31.3
  Top Layer w0.254: U5.54 86.23,46.73 70.36,46.73 68.58,44.95 68.58,36.57 U10.3
20.12: length 32.5
  Top Layer w0.254: U10.5 65.28,39.74 64.26,40.76 64.26,49.14 65.66,50.54 U5.55
20.13: length 31.2
  Top Layer w0.254: U5.56 86.23,49.27 65.53,49.27 64.9,48.63 64.9,42.92 65.53,42.28 U10.6
20.14: length 40.5
  Top Layer w0.254: U5.57 86.11,51.68 65.41,51.68 63.5,49.77 63.5,38.22 64.52,37.2 66.68,37.2
21.2: length 75.6
  Top Layer w0.254: R34.1 v1(41.88,5.58)
  Bottom Layer w0.254: v1(41.88,5.58) 41.88,2.44 43.18,1.13 86.61,1.13 90.61,5.13 90.61,16.82 88.65,18.79 86.23,18.79 U5.38
21.3: length 43.3
  Top Layer w0.254: R36.2 59.05,5.58 v1(60.61,5.58)
  Bottom Layer w0.254: U5.39 87.5,3.55 85.98,2.02 62.23,2.02 60.61,3.64 v1(60.61,5.58)
21.4: length 63.6
  Top Layer w0.254: v1(43.06,2.91) R35.1
  Bottom Layer w0.254: v1(43.06,2.91) 44.46,1.51 86.23,1.51 89.41,4.69 89.41,15.74 87.63,17.52 U5.40
21.5: length 48.4
  Top Layer w0.254: U5.41 87.76,20.06 90.17,17.64 90.17,7.48 83.82,1.13 60.95,1.13 59.17,2.91 R37.2
22.0: length 22.1
  Top Layer w0.254: 79.88,17.52 81.15,16.25 81.15,3.29 80.65,2.78 76.2,2.78 H4.5
22.1: length 26.7
  Top Layer w0.254: U5.35 82.42,3.16 81.53,2.28 70.1,2.28 69.6,2.78 H4.1
22.2: length 18.6
  Bottom Layer w0.254: H4.4 73.79,8.5 80.14,8.5 81.15,9.51 81.15,16.25 U5.36
22.3: length 37.1
  Top Layer w0.254: H4.3 70.87,5.58 68.33,5.58 67.56,4.82 67.56,3.16 68.96,1.77 83.06,1.77 84.96,3.67 U5.37
23.1: length 8.2
  Top Layer w0.254: 79.88,14.98 79.88,6.97 H4.10
33.10: length 10.3
  Top Layer w0.254: U5.28 72.26,18.66 71.88,19.04 67.31,19.04 66.68,19.67 R13.1 R12.1
A11: length 9
  Top Layer w0.254: 51.94,14.98 52,14.91 52,9.9 51.95,9.84 R10.1 50.43,8.12 R9.2
$1N3689: length 2.9
  Top Layer w0.254: 45.88,32.22 45.88,32.25 C1.1
$1N3695: length 8.2
  Top Layer w0.254: 51.28,32.22 51.28,32.25 C1.2 47.48,36.05 47.48,38.85
$1N3701:
  vias: v1(29.38,58.28) v1(30.12,64.38) v1(30.23,58.28) v1(31.11,58.28) v1(43.5,29.5) v1(43.75,31.87) v1(46.13,30.95) v1(46.13,29.68)
$1N4253: length 2.3
  Top Layer w0.254: U6.4 46.13,26.23 R1.2
$1N4305: length 2.5
  Top Layer w0.254: 51.28,29.68 53.77,29.68 53.78,29.66
$1N4403: length 2.2
  Top Layer w0.254: R2.1 54.04,27.5 C5.2
$1N4480: length 17.2
  Top Layer w0.254: D2.1 58.55,30.05 58.55,36.06 54.92,36.06 C6.2 54.1,37.22 L1.2
$1N4838: length 2.3
  Top Layer w0.254: R4.2 51.31,22.36 R3.1
$1N4842: length 5.3
  Top Layer w0.254: U6.5 51.53,26.36 R4.1 48.39,26.14
$1N5194: length 2.2
  Top Layer w0.254: R6.1 33.67,15.53 LED1.2
$1N5860: length 2.4
  Top Layer w0.254: R7.2 17.69,17.32 LED2.2
$1N6807: length 26.8
  Top Layer w1.27: Q1.1 18.36,61.45 21.42,64.5 22.35,65.65 22.35,75.62 20.76,77.21 17.65,77.21 15.11,74.67 SW12.2
$1N8656: length 5
  Top Layer w0.254: BUZZER1.1 69.86,25.14 R11.2
$1N8703: length 10.7
  Top Layer w0.254: BUZZER1.2 74.16,21.83 Q2.3
$1N8826: length 2.1
  Top Layer w0.254: R12.2 70.21,22.85 Q2.1
$1N25852: length 11.8
  Top Layer w0.254: U21.1 91.5,41.13 R30.1 82.29,41.14 R24.2
$1N25895: length 19.8
  Top Layer w0.254: R25.2 R31.1 85.1,40.38 96.9,40.38 97.41,40.88 U22.1
$1N25944: length 21.5
  Top Layer w0.254: U23.1 95.95,37.71 84.2,37.71 83.31,36.82 81.27,36.82 R26.2 79.62,38.47 77.73,38.47 R32.1
$1N25995: length 16.8
  Top Layer w0.254: U24.1 85.28,36.63 83.57,34.92 81.4,34.92 R27.2 79.49,34.79 78.24,34.79 R33.1
$1N43385: length 3.1
  Top Layer w0.254: R35.2 49.15,2.91 H5.1
$1N43389: length 3.1
  Top Layer w0.254: H5.2 R34.2
$1N43393: length 3.2
  Top Layer w0.254: 57.54,5.58 H5.6
$1N43397: length 3.1
  Top Layer w0.254: H5.5 57.29,3.04 R37.1

## Copper pours and planes (outline as drawn; the poured copper is in the pictures)
3V on Inner2: 58.93,18.69 81.78,18.69 81.41,57.27 60.1,67.63 34.16,67.63 34.16,44.97 62.59,44.97 62.59,31.95 58.93,24.78
+5V on Inner2: 32.13,11.41 32.13,25.28 58.44,25.28 58.55,11.16
GND on Top Layer: -8.76,89.53 101.85,89.53 113.28,78.09 113.28,0.12 102.87,-10.3 4.44,-10.3 -9.91,4.05 -9.91,89.65 -9.27,90.29 -8.76,89.78
GND on Bottom Layer: -21.72,101.46 122.81,101.46 122.81,-24.9 -21.72,-24.9
GND on Inner1: -13.46,97.53 116.08,97.53 116.08,-17.54 -13.46,-17.54
VCC on Inner2: 11.56,51.17 11.56,58.73 11.89,59.06 19.54,59.06 24.64,64.15 24.64,71.13 28.83,71.13 28.83,66.87 27.59,65.63 27.59,62.06 27.69,61.97 27.59,61.87 27.59,53.02 20.77,53.02 18.92,51.17
$1N3701 on Inner2: 28.07,65.9 33.27,65.9 33.53,44.95 43.93,32.92 44.83,32.92 44.83,31.61 46.99,31.61 46.99,28.99 44.94,28.99 44.25,28.51 41.15,28.51 41.15,30.56 31.62,42.18 31.62,45.08 28.07,48.2
$1N5984 on Top Layer: 11.68,80.76 11.94,80.51 11.94,71.83 15.11,68.66 15.11,59.43 10.16,59.43 10.16,58.82 10.16,58.66 10.16,56.5 8.76,55.11 -0.51,55.11 -1.14,55.74 -1.14,80.1 -0.48,80.76
$1N6140 on Top Layer: 16.1,75.56 21.08,75.56 21.08,67.37 16.1,67.37

Small or netless copper shapes (teardrops, artwork), in the pictures only: 141 on Top Layer, 53 on Bottom Layer, 3 on Inner2

## Text on the board
Top Layer: 2025.9.30 | 逐电骖鸾盟
Top Silkscreen Layer: 3v | - | + | 5v | SPI | 舵机信号 | 摄像头 | 无线串口 | 屏幕 | 定位模块
